# Altium project GALX4-0047N_PCB-1109N_REV-A.PrjPcb
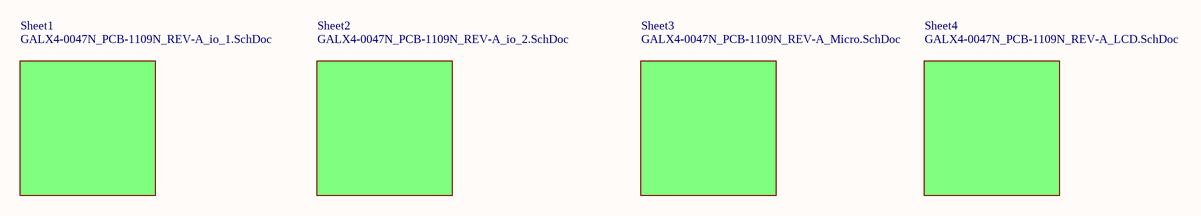
[diagram p0: GALX4-0047N_PCB-1109N_REV-A_Master.SchDoc]
5 sheets, 244 parts. Net scope: flat (ports and power ports of the same name join across sheets).
Board files: GALX4-0047N_PCB-1109N_REV-A_Panel.PcbDoc, GALX4-0047N_PCB-1109N_REV-A.PcbDoc
Sheets:
  GALX4-0047N_PCB-1109N_REV-A_Master.SchDoc
    Sheet1 = GALX4-0047N_PCB-1109N_REV-A_io_1.SchDoc
    Sheet2 = GALX4-0047N_PCB-1109N_REV-A_io_2.SchDoc
    Sheet3 = GALX4-0047N_PCB-1109N_REV-A_Micro.SchDoc
    Sheet4 = GALX4-0047N_PCB-1109N_REV-A_LCD.SchDoc

## Sheet GALX4-0047N_PCB-1109N_REV-A_Master.SchDoc
size 431 x 279 mm

### Sub-sheets
Sheet1 = GALX4-0047N_PCB-1109N_REV-A_io_1.SchDoc: no entries
Sheet2 = GALX4-0047N_PCB-1109N_REV-A_io_2.SchDoc: no entries
Sheet3 = GALX4-0047N_PCB-1109N_REV-A_Micro.SchDoc: no entries
Sheet4 = GALX4-0047N_PCB-1109N_REV-A_LCD.SchDoc: no entries

## Sheet GALX4-0047N_PCB-1109N_REV-A_io_1.SchDoc
size 431 x 279 mm; SheetNumber: 1; SheetTotal: 1; DocumentName: Sheet1.SCHDOC
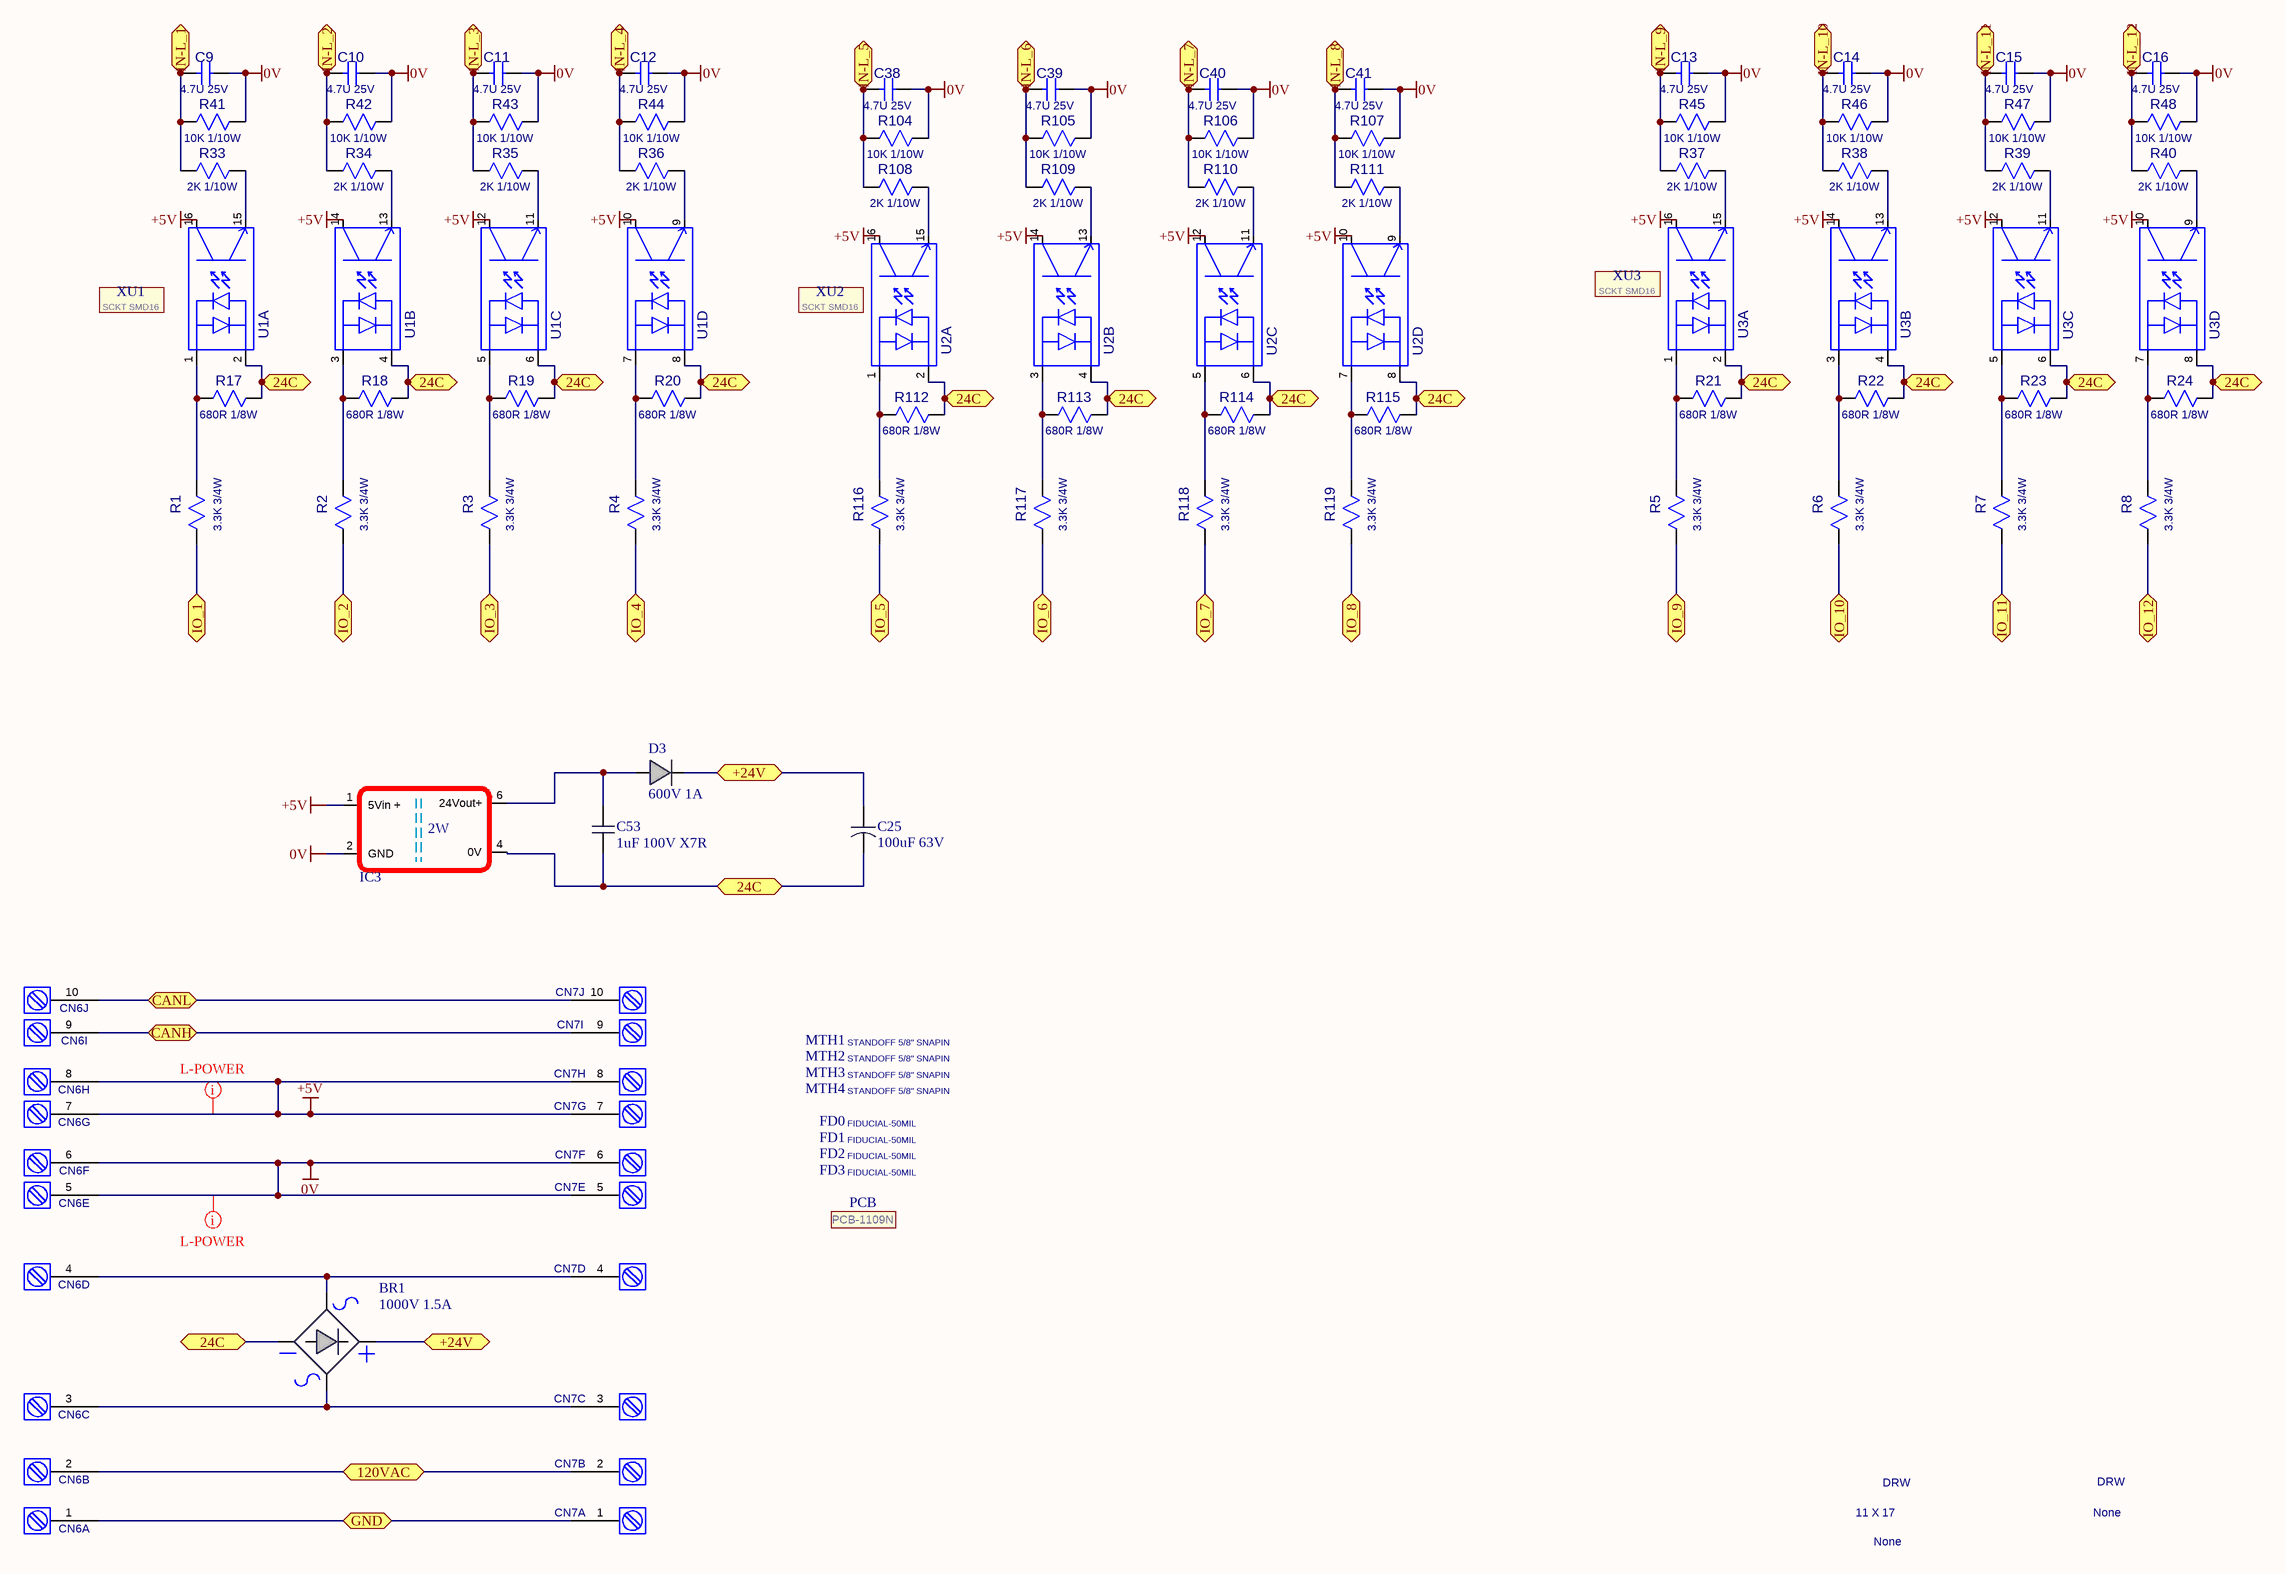
[diagram p1: GALX4-0047N_PCB-1109N_REV-A_io_1.SchDoc]

### Parts
BR1  1000V 1.5A  [SDIP4]
C9  value 4.7U 25V  [0805]  (hidden comment: CAP-0098N)
C10  value 4.7U 25V  [0805]  (hidden comment: CAP-0098N)
C11  value 4.7U 25V  [0805]  (hidden comment: CAP-0098N)
C12  value 4.7U 25V  [0805]  (hidden comment: CAP-0098N)
C13  value 4.7U 25V  [0805]  (hidden comment: CAP-0098N)
C14  value 4.7U 25V  [0805]  (hidden comment: CAP-0098N)
C15  value 4.7U 25V  [0805]  (hidden comment: CAP-0098N)
C16  value 4.7U 25V  [0805]  (hidden comment: CAP-0098N)
C25  100uF 63V  [D10.3]
C38  value 4.7U 25V  [0805]  (hidden comment: CAP-0098N)
C39  value 4.7U 25V  [0805]  (hidden comment: CAP-0098N)
C40  value 4.7U 25V  [0805]  (hidden comment: CAP-0098N)
C41  value 4.7U 25V  [0805]  (hidden comment: CAP-0098N)
C53  1uF 100V X7R  [1206 - CAP]
CN6  CONN-0193N  [CN_150_10P_VERT]  (value not drawn)  (parts A,B,C,D,E,F,G,H,I,J of 10)
CN7  CONN-0193N  [CN_150_10P_VERT]  (value not drawn)  (parts A,B,C,D,E,F,G,H,I,J of 10)
D3  600V 1A  [SMA]
FD0  FIDUCIAL-50MIL  [FIDUCIAL-50MIL]  (no BOM)
FD1  FIDUCIAL-50MIL  [FIDUCIAL-50MIL]  (no BOM)
FD2  FIDUCIAL-50MIL  [FIDUCIAL-50MIL]  (no BOM)
FD3  FIDUCIAL-50MIL  [FIDUCIAL-50MIL]  (no BOM)
IC3  PDM2-S5-S24-S  [PDM2-S5-S24-S]  (value not drawn)
MTH1  value STANDOFF 5/8" SNAPIN  [STANDOFF-8-5/8"]  (hidden comment: HWPC-0018N)
MTH2  value STANDOFF 5/8" SNAPIN  [STANDOFF-8-5/8"]  (hidden comment: HWPC-0018N)
MTH3  value STANDOFF 5/8" SNAPIN  [STANDOFF-8-5/8"]  (hidden comment: HWPC-0018N)
MTH4  value STANDOFF 5/8" SNAPIN  [STANDOFF-8-5/8"]  (hidden comment: HWPC-0018N)
PCB  GAL P/N: PCB-1109N  (hidden comment: PCB)  (mechanical)
R1  value 3.3K 3/4W  [2010]  (hidden comment: RES-0348N)
R2  value 3.3K 3/4W  [2010]  (hidden comment: RES-0348N)
R3  value 3.3K 3/4W  [2010]  (hidden comment: RES-0348N)
R4  value 3.3K 3/4W  [2010]  (hidden comment: RES-0348N)
R5  value 3.3K 3/4W  [2010]  (hidden comment: RES-0348N)
R6  value 3.3K 3/4W  [2010]  (hidden comment: RES-0348N)
R7  value 3.3K 3/4W  [2010]  (hidden comment: RES-0348N)
R8  value 3.3K 3/4W  [2010]  (hidden comment: RES-0348N)
R17  value 680R 1/8W  [0805]  (hidden comment: RES-0338N)
R18  value 680R 1/8W  [0805]  (hidden comment: RES-0338N)
R19  value 680R 1/8W  [0805]  (hidden comment: RES-0338N)
R20  value 680R 1/8W  [0805]  (hidden comment: RES-0338N)
R21  value 680R 1/8W  [0805]  (hidden comment: RES-0338N)
R22  value 680R 1/8W  [0805]  (hidden comment: RES-0338N)
R23  value 680R 1/8W  [0805]  (hidden comment: RES-0338N)
R24  value 680R 1/8W  [0805]  (hidden comment: RES-0338N)
R33  value 2K 1/10W  [0603]  (hidden comment: RES-0315N)
R34  value 2K 1/10W  [0603]  (hidden comment: RES-0315N)
R35  value 2K 1/10W  [0603]  (hidden comment: RES-0315N)
R36  value 2K 1/10W  [0603]  (hidden comment: RES-0315N)
R37  value 2K 1/10W  [0603]  (hidden comment: RES-0315N)
R38  value 2K 1/10W  [0603]  (hidden comment: RES-0315N)
R39  value 2K 1/10W  [0603]  (hidden comment: RES-0315N)
R40  value 2K 1/10W  [0603]  (hidden comment: RES-0315N)
R41  value 10K 1/10W  [0603]  (hidden comment: RES-0314N)
R42  value 10K 1/10W  [0603]  (hidden comment: RES-0314N)
R43  value 10K 1/10W  [0603]  (hidden comment: RES-0314N)
R44  value 10K 1/10W  [0603]  (hidden comment: RES-0314N)
R45  value 10K 1/10W  [0603]  (hidden comment: RES-0314N)
R46  value 10K 1/10W  [0603]  (hidden comment: RES-0314N)
R47  value 10K 1/10W  [0603]  (hidden comment: RES-0314N)
R48  value 10K 1/10W  [0603]  (hidden comment: RES-0314N)
R104  value 10K 1/10W  [0603]  (hidden comment: RES-0314N)
R105  value 10K 1/10W  [0603]  (hidden comment: RES-0314N)
R106  value 10K 1/10W  [0603]  (hidden comment: RES-0314N)
R107  value 10K 1/10W  [0603]  (hidden comment: RES-0314N)
R108  value 2K 1/10W  [0603]  (hidden comment: RES-0315N)
R109  value 2K 1/10W  [0603]  (hidden comment: RES-0315N)
R110  value 2K 1/10W  [0603]  (hidden comment: RES-0315N)
R111  value 2K 1/10W  [0603]  (hidden comment: RES-0315N)
R112  value 680R 1/8W  [0805]  (hidden comment: RES-0338N)
R113  value 680R 1/8W  [0805]  (hidden comment: RES-0338N)
R114  value 680R 1/8W  [0805]  (hidden comment: RES-0338N)
R115  value 680R 1/8W  [0805]  (hidden comment: RES-0338N)
R116  value 3.3K 3/4W  [2010]  (hidden comment: RES-0348N)
R117  value 3.3K 3/4W  [2010]  (hidden comment: RES-0348N)
R118  value 3.3K 3/4W  [2010]  (hidden comment: RES-0348N)
R119  value 3.3K 3/4W  [2010]  (hidden comment: RES-0348N)
U1  IC-0068N  [DIP16FORSMD]  (value not drawn)  (parts A,B,C,D of 4)
U2  IC-0068N  [DIP16FORSMD]  (value not drawn)  (parts A,B,C,D of 4)
U3  IC-0068N  [DIP16FORSMD]  (value not drawn)  (parts A,B,C,D of 4)
XU1  value SCKT SMD16  [SCKT-SMD16]  (hidden comment: SCKT-0029N)
XU2  value SCKT SMD16  [SCKT-SMD16]  (hidden comment: SCKT-0029N)
XU3  value SCKT SMD16  [SCKT-SMD16]  (hidden comment: SCKT-0029N)

### Ports
24C, 120VAC (bidir), +24V, CANH, CANL, GND, IN-L_1, IN-L_2, IN-L_3, IN-L_4, IN-L_5, IN-L_6, IN-L_7, IN-L_8, IN-L_9 (bidir), IN-L_10 (bidir), IN-L_11 (bidir), IN-L_12 (bidir), IO_1, IO_2, IO_3, IO_4, IO_5, IO_6, IO_7, IO_8, IO_9 (bidir), IO_10 (bidir), IO_11 (bidir), IO_12 (bidir)

### Nets
0V: C9.2(B) C10.2(B) C11.2(B) C12.2(B) C13.2(B) C14.2(B) C15.2(B) C16.2(B) C38.2(B) C39.2(B) C40.2(B) C41.2(B) CN6.5 CN6.6 CN7.5 CN7.6 IC3.2(GND) R41.2 R42.2 R43.2 R44.2 R45.2 R46.2 R47.2 R48.2 R104.2 R105.2 R106.2 R107.2
+5V: CN6.7 CN6.8 CN7.7 CN7.8 IC3.1(5Vin_+) U1.10 U1.12 U1.14 U1.16 U2.10 U2.12 U2.14 U2.16 U3.10 U3.12 U3.14 U3.16
24C: BR1.2(-) C25.2 C53.1(A) IC3.4(0V) R17.2 R18.2 R19.2 R20.2 R21.2 R22.2 R23.2 R24.2 R112.2 R113.2 R114.2 R115.2 U1.2 U1.4 U1.6 U1.8 U2.2 U2.4 U2.6 U2.8 U3.2 U3.4 U3.6 U3.8 ; port 24C
120VAC: CN6.2 CN7.2 ; port 120VAC
+24V: BR1.1(+) C25.1 D3.2 ; port +24V
CANH: CN6.9 CN7.9 ; port CANH
CANL: CN6.10 CN7.10 ; port CANL
GND: CN6.1 CN7.1 ; port GND
IN-L_1: C9.1(A) R33.1 R41.1 ; port IN-L_1
IN-L_2: C10.1(A) R34.1 R42.1 ; port IN-L_2
IN-L_3: C11.1(A) R35.1 R43.1 ; port IN-L_3
IN-L_4: C12.1(A) R36.1 R44.1 ; port IN-L_4
IN-L_5: C38.1(A) R104.1 R108.1 ; port IN-L_5
IN-L_6: C39.1(A) R105.1 R109.1 ; port IN-L_6
IN-L_7: C40.1(A) R106.1 R110.1 ; port IN-L_7
IN-L_8: C41.1(A) R107.1 R111.1 ; port IN-L_8
IN-L_9: C13.1(A) R37.1 R45.1 ; port IN-L_9
IN-L_10: C14.1(A) R38.1 R46.1 ; port IN-L_10
IN-L_11: C15.1(A) R39.1 R47.1 ; port IN-L_11
IN-L_12: C16.1(A) R40.1 R48.1 ; port IN-L_12
IO_1: R1.1 ; port IO_1
IO_2: R2.1 ; port IO_2
IO_3: R3.1 ; port IO_3
IO_4: R4.1 ; port IO_4
IO_5: R116.1 ; port IO_5
IO_6: R117.1 ; port IO_6
IO_7: R118.1 ; port IO_7
IO_8: R119.1 ; port IO_8
IO_9: R5.1 ; port IO_9
IO_10: R6.1 ; port IO_10
IO_11: R7.1 ; port IO_11
IO_12: R8.1 ; port IO_12
NetBR1_3: BR1.3(AC_1) CN6.4 CN7.4
NetBR1_4: BR1.4(AC_2) CN6.3 CN7.3
NetC53_2: C53.2(B) D3.1 IC3.6(24Vout+)
NetR1_2: R1.2 R17.1 U1.1
NetR2_2: R2.2 R18.1 U1.3
NetR3_2: R3.2 R19.1 U1.5
NetR4_2: R4.2 R20.1 U1.7
NetR5_2: R5.2 R21.1 U3.1
NetR6_2: R6.2 R22.1 U3.3
NetR7_2: R7.2 R23.1 U3.5
NetR8_2: R8.2 R24.1 U3.7
NetR33_2: R33.2 U1.15
NetR34_2: R34.2 U1.13
NetR35_2: R35.2 U1.11
NetR36_2: R36.2 U1.9
NetR37_2: R37.2 U3.15
NetR38_2: R38.2 U3.13
NetR39_2: R39.2 U3.11
NetR40_2: R40.2 U3.9
NetR108_2: R108.2 U2.15
NetR109_2: R109.2 U2.13
NetR110_2: R110.2 U2.11
NetR111_2: R111.2 U2.9
NetR112_1: R112.1 R116.2 U2.1
NetR113_1: R113.1 R117.2 U2.3
NetR114_1: R114.1 R118.2 U2.5
NetR115_1: R115.1 R119.2 U2.7

### Layout directives
net class L-POWER: 0V, +5V

### Notes on the sheet
- DRW
- 11 X 17
- None
- TITLE:
- S
- DWG BY
- E
- L
- V
- A
- T
- O
- R
- D
- I
- C
- 50 EAST 153rd STREET
- ENGINEER
- DWG. No.
- BRONX, N.Y. 10451
- REV
- DESCRIPTION
- ECN NO.
- DATE
- SIZE
- SCALE
- PART No.
- FILE NAME
- SHEET __ 0F __
- REV.
- (in symbol IC-PDM2-S5-S24-S) 2W

### Library data of the parts
BR1 = DIOD-0081N: DIODE,RECT BRIDGE 1000V 1.5A 4SDIP SMT; MANUFACTURER: FAIRCHILD; MFG PART ID: DF10S; PLACE: S; UNIT $: 0.1144; Value: 1000V 1.5A BR; CERTIFICATES/APPROVALS: UL #E111753 and E326243.; GAL DESC.: DIODE,RECT BRIDGE 1000V 1.5A 4SDIP SMT; GAL P/N: DIOD-0081N; PART TYPE: SDIP4; TEMPERATURE: -55 to +150 C; RoHs COMPLIANT: YES
C9-C16 C38-C41 = CAP-0098N: C-0805-D-4.7U-25V-10%; MANUFACTURER: MURATA; MFG PART ID: GRM21BR61E475KA12L; GAL DESC.: CAP 4.7UF 25V 10% CERM 0805 SMT; PLACE: S; UNIT $: $0.0520; GAL P/N: CAP-0098N; PART TYPE: 0805-050; VENDOR: *; VENDOR ID: *
C25 = CAP-0104N: CAP, 100UF 63V ELECT 20% 10.3MM SMT; MANUFACTURER: UNITED CHEMICON; MFG PART ID: EMVE630ADA101MJA0G; PLACE: S; UNIT $: 0.3; GAL DESC.: CAP, 100UF 63V ELECT 20% 10.3MM SMT; GAL P/N: CAP-0104N; PART TYPE: D10.3; TEMPERATURE: -40°C ~ 105°C; Value: 100uF 63V
C53 = CAP-0110N: CAP, 1UF 100V 10% X7R CERM 1206 SMT; MANUFACTURER: MURATA; MFG PART ID: GRM31CR72A105KA01L; PLACE: S; UNIT $: 0.12016; GAL DESC.: CAP, 1UF 100V 10% X7R CERM 1206 SMT; GAL P/N: CAP-0110N; PART TYPE: 1206; RoHs COMPLIANT: YES; TEMPERATURE: -55°C ~ 125°C; Value: 1uF 100V X7R
CN6 CN7 = CONN-0193N: CN_150_10P_VERT; MANUFACTURER: PHOENIX; Value: 250V 8A; VENDOR ID: 1803507; GAL DESC.: CONN,HEADER 10 POS PCB TERMINAL 3.81 MM; PLACE: M; UNIT $: $0.8500; VENDOR: SAGER; GAL P/N: CONN-0193N; PART TYPE: CONN-0193N; MFG PART ID: 1803507
D3 = DIOD-0077N: DIODE,FAST 600V 1A SMA SMT; MANUFACTURER: STMICRO; MFG PART ID: STTH1L06A; PLACE: S; UNIT $: 0.102; CERTIFICATES/APPROVALS: Epoxy meets UL 94, V0; GAL DESC.: DIODE,FAST 600V 1A SMA SMT; GAL P/N: DIOD-0077N; PART TYPE: SMA; TEMPERATURE: -65°C ~ 175°C; Value: 600V 1A
IC3 = IC-PDM2-S5-S24-S: CONV DC/DC 2W  5 --> 24V OUT SIP4; MANUFACTURER: CUI INC; CERTIFICATES/APPROVALS: UL; GAL DESC.: CONV DC/DC 2W SGL 5V-->24V OUT SIP4; PLACE: M; UNIT $: 4.57; Value: 5V to 24V 2W Boost; HelpURL: http://www.cui.com/product/resource/pdm2-s.pdff; MFG PART ID: PDM2-S5-S24-S; PART TYPE: SIP 4 MODULE; RoHs COMPLIANT: YES; TEMPERATURE: -40°C ~ 85°C
MTH1-MTH4 = HWPC-0018N: STANDOFF-5/8-SNAP; MANUFACTURER: KEYSTONE; MFG PART ID: 8842; UNIT $: $0.0773; PLACE: PW; GAL DESC.: STANDOFF,SNAP IN NYLON 5/8" LG; VENDOR: *; PART TYPE: HWPC-0018N; GAL P/N: HWPC-0018N; VENDOR ID: *
PCB = PCB: PCB-0205N; MANUFACTURER: CIRCUIT ENG; MFG PART ID: PCB-0176N; UNIT $: $5.0000; PLACE: M; GAL DESC.: PCB, GALX-1078AN REV B; VENDOR: *; PART TYPE: PCB; VENDOR ID: *
R1-R8 R116-R119 = RES-0348N: R-2010-B-3.3K-3/4-5%; MANUFACTURER: KOA SPEER; MFG PART ID: RK73B2HTTE332J; PLACE: S; GAL DESC.: RES, 3.3KOHM 3/4W 5% 2010 SMT; UNIT $: $0.0050; GAL P/N: RES-0348N; PART TYPE: 2010; VENDOR: *; VENDOR ID: *
R17-R24 R112-R115 = RES-0338N: R-0805-A-680R-1/8-5%; MANUFACTURER: YAGEO; MFG PART ID: RC0805JR-07680RL; PLACE: S; GAL DESC.: RES, 680 OHM 1/8W 5% 0805 SMT; UNIT $: $0.0038; GAL P/N: RES-0338N; PART TYPE: 0805; VENDOR: *; VENDOR ID: *
R33-R40 R108-R111 = RES-0315N: R-0603-B-2.0K-1/10-5%; MANUFACTURER: PANASONIC-ECG; MFG PART ID: ERJ-3GEYJ202V; PLACE: S; GAL DESC.: RES, 2.0KOHM 1/10W 5% 0603 SMT; UNIT $: $0.0024; GAL P/N: RES-0315N; PART TYPE: 0603; VENDOR: *; VENDOR ID: *
R41-R48 R104-R107 = RES-0314N: R-0603-B-10.0K-1/10-5%; MANUFACTURER: PANASONIC-ECG; MFG PART ID: ERJ-3GEYJ103V; PLACE: S; GAL DESC.: RES, 10.0KOHM 1/10W 5% 0603 SMT; UNIT $: $0.0024; GAL P/N: RES-0314N; PART TYPE: 0603; VENDOR: *; VENDOR ID: *
U1-U3 = IC-0068N: LTV-844-DIP16; MANUFACTURER: LITE-ON; GAL DESC.: IC,OPTOISOLATOR 4CH AC-IN 16PIN DIP; UNIT $: $0.6477; PLACE: D; REPAIR: -00002; SLOT: 00337; Value: IC-0068N; GAL P/N: IC-0068N; VENDOR ID: *; VENDOR: *; MFG PART ID: LTV-844; PART TYPE: DIP16; DEPTH: +00001
XU1-XU3 = SCKT-0029N: SOCKET_SMD16; MANUFACTURER: MILL-MAX; MFG PART ID: 214-44-316-01-670800; UNIT $: $0.8000; PLACE: S; GAL DESC.: SOCKET,16 PIN CLOSED FRAME 16SMD SMT; VENDOR: *; PART TYPE: SCKT_SMD16; GAL P/N: SCKT-0029N; VENDOR ID: *
FD0-FD3 = FIDUCIAL-50MIL: MANUFACTURER: *; VENDOR: *; PART TYPE: *; UNIT $: *; MFG PART ID: *; PLACE: *; GAL P/N: *; VENDOR ID: *; GAL DESC.: FIDUCIAL; Value: FIDUCIAL-50MIL

## Sheet GALX4-0047N_PCB-1109N_REV-A_io_2.SchDoc
size 431 x 279 mm; SheetNumber: 1; SheetTotal: 1; DocumentName: Sheet1.SCHDOC
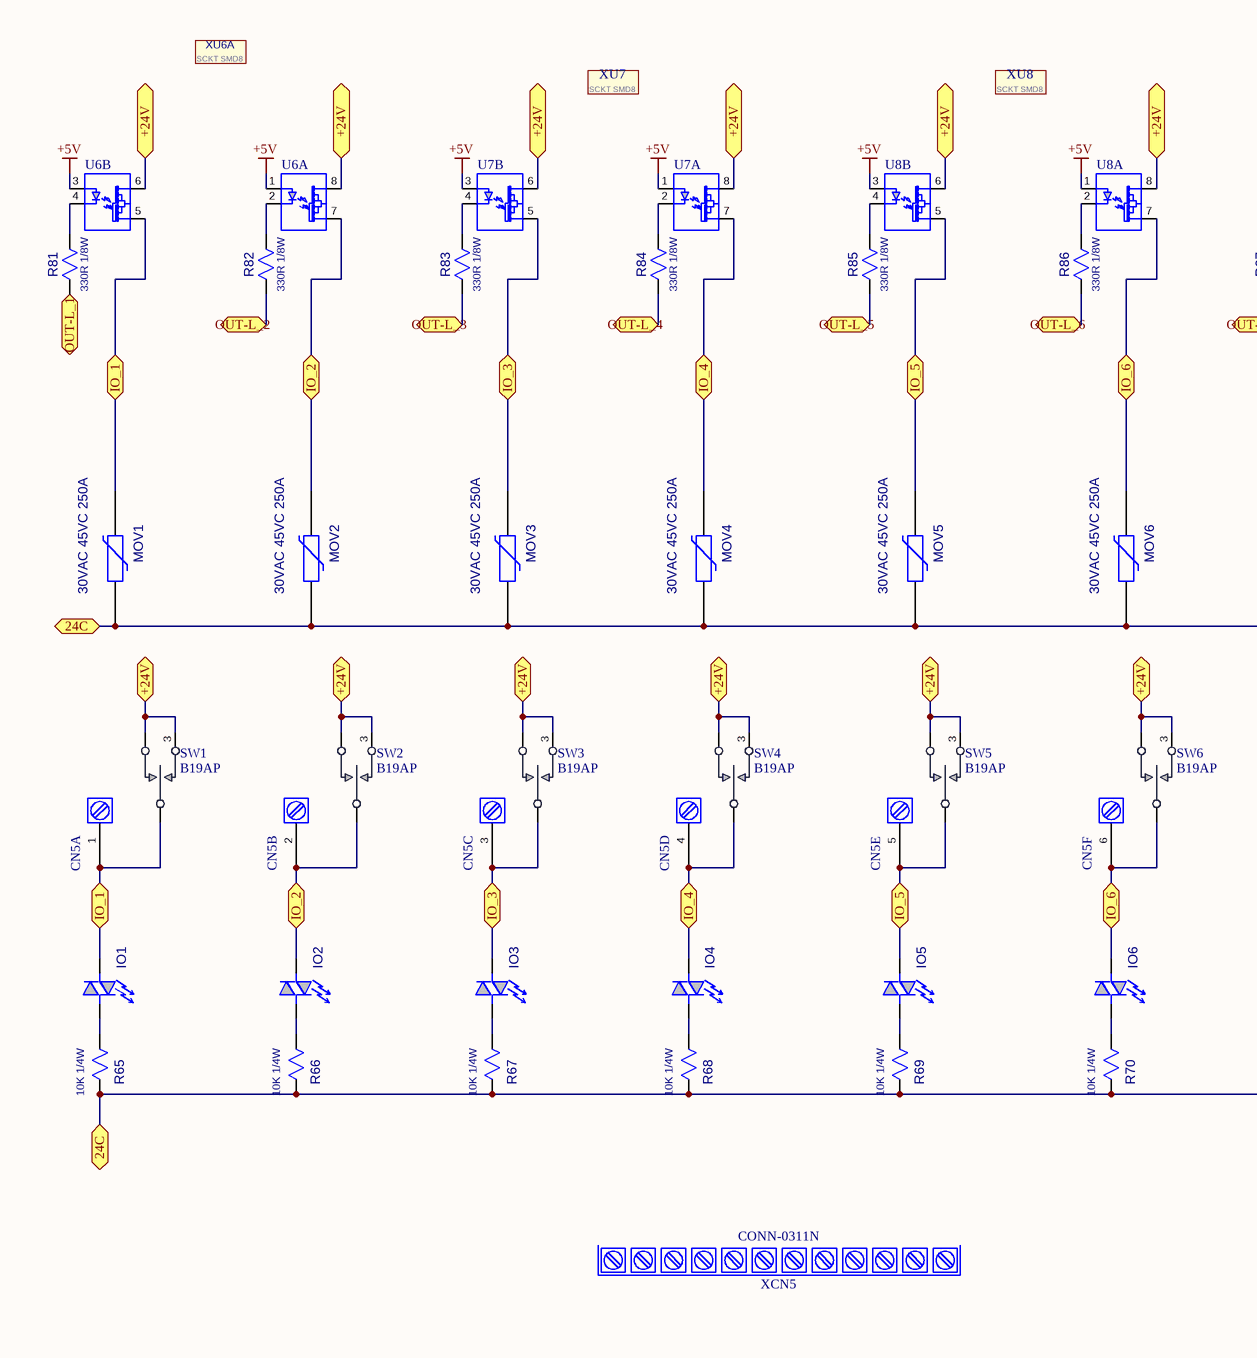
[diagram p2: GALX4-0047N_PCB-1109N_REV-A_io_2.SchDoc, left]
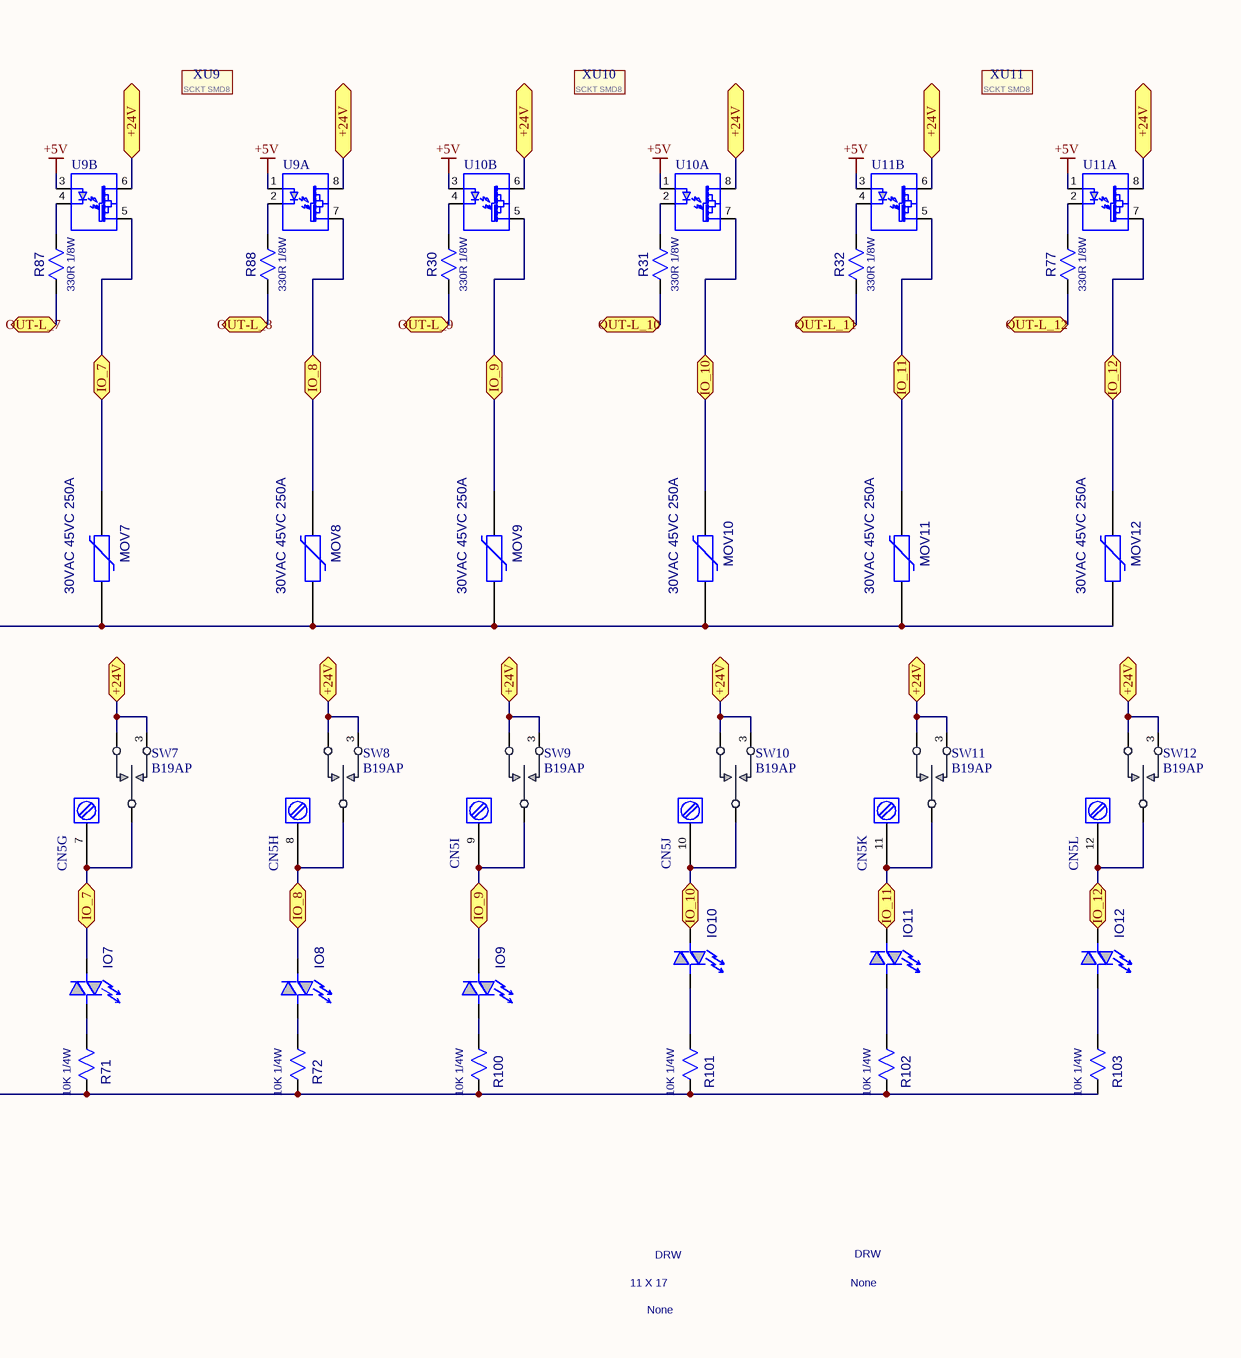
[diagram p3: GALX4-0047N_PCB-1109N_REV-A_io_2.SchDoc, right]

### Parts
CN5  CONN-0310N  [CNPIN-5MM-12P-NOSCR]  (value not drawn)  (parts A,B,C,D,E,F,G,H,I,J,K,L of 12)
IO1  LED-0013N  [1206-LED-GREEN]  (value not drawn)
IO2  LED-0013N  [1206-LED-GREEN]  (value not drawn)
IO3  LED-0013N  [1206-LED-GREEN]  (value not drawn)
IO4  LED-0013N  [1206-LED-GREEN]  (value not drawn)
IO5  LED-0013N  [1206-LED-GREEN]  (value not drawn)
IO6  LED-0013N  [1206-LED-GREEN]  (value not drawn)
IO7  LED-0013N  [1206-LED-GREEN]  (value not drawn)
IO8  LED-0013N  [1206-LED-GREEN]  (value not drawn)
IO9  LED-0013N  [1206-LED-GREEN]  (value not drawn)
IO10  LED-0013N  [1206-LED-GREEN]  (value not drawn)
IO11  LED-0013N  [1206-LED-GREEN]  (value not drawn)
IO12  LED-0013N  [1206-LED-GREEN]  (value not drawn)
MOV1  value 30VAC 45VC 250A  [DISC-280DX150WX200P]  (hidden comment: MOV-0012N)
MOV2  value 30VAC 45VC 250A  [DISC-280DX150WX200P]  (hidden comment: MOV-0012N)
MOV3  value 30VAC 45VC 250A  [DISC-280DX150WX200P]  (hidden comment: MOV-0012N)
MOV4  value 30VAC 45VC 250A  [DISC-280DX150WX200P]  (hidden comment: MOV-0012N)
MOV5  value 30VAC 45VC 250A  [DISC-280DX150WX200P]  (hidden comment: MOV-0012N)
MOV6  value 30VAC 45VC 250A  [DISC-280DX150WX200P]  (hidden comment: MOV-0012N)
MOV7  value 30VAC 45VC 250A  [DISC-280DX150WX200P]  (hidden comment: MOV-0012N)
MOV8  value 30VAC 45VC 250A  [DISC-280DX150WX200P]  (hidden comment: MOV-0012N)
MOV9  value 30VAC 45VC 250A  [DISC-280DX150WX200P]  (hidden comment: MOV-0012N)
MOV10  value 30VAC 45VC 250A  [DISC-280DX150WX200P]  (hidden comment: MOV-0012N)
MOV11  value 30VAC 45VC 250A  [DISC-280DX150WX200P]  (hidden comment: MOV-0012N)
MOV12  value 30VAC 45VC 250A  [DISC-280DX150WX200P]  (hidden comment: MOV-0012N)
R30  value 330R 1/8W  [0805]  (hidden comment: RES-0291N)
R31  value 330R 1/8W  [0805]  (hidden comment: RES-0291N)
R32  value 330R 1/8W  [0805]  (hidden comment: RES-0291N)
R65  value 10K 1/4W  [1206]  (hidden comment: RES-0294N)
R66  value 10K 1/4W  [1206]  (hidden comment: RES-0294N)
R67  value 10K 1/4W  [1206]  (hidden comment: RES-0294N)
R68  value 10K 1/4W  [1206]  (hidden comment: RES-0294N)
R69  value 10K 1/4W  [1206]  (hidden comment: RES-0294N)
R70  value 10K 1/4W  [1206]  (hidden comment: RES-0294N)
R71  value 10K 1/4W  [1206]  (hidden comment: RES-0294N)
R72  value 10K 1/4W  [1206]  (hidden comment: RES-0294N)
R77  value 330R 1/8W  [0805]  (hidden comment: RES-0291N)
R81  value 330R 1/8W  [0805]  (hidden comment: RES-0291N)
R82  value 330R 1/8W  [0805]  (hidden comment: RES-0291N)
R83  value 330R 1/8W  [0805]  (hidden comment: RES-0291N)
R84  value 330R 1/8W  [0805]  (hidden comment: RES-0291N)
R85  value 330R 1/8W  [0805]  (hidden comment: RES-0291N)
R86  value 330R 1/8W  [0805]  (hidden comment: RES-0291N)
R87  value 330R 1/8W  [0805]  (hidden comment: RES-0291N)
R88  value 330R 1/8W  [0805]  (hidden comment: RES-0291N)
R100  value 10K 1/4W  [1206]  (hidden comment: RES-0294N)
R101  value 10K 1/4W  [1206]  (hidden comment: RES-0294N)
R102  value 10K 1/4W  [1206]  (hidden comment: RES-0294N)
R103  value 10K 1/4W  [1206]  (hidden comment: RES-0294N)
SW1  ON-OFF-MON  [B19AP]  (value not drawn)
SW2  ON-OFF-MON  [B19AP]  (value not drawn)
SW3  ON-OFF-MON  [B19AP]  (value not drawn)
SW4  ON-OFF-MON  [B19AP]  (value not drawn)
SW5  ON-OFF-MON  [B19AP]  (value not drawn)
SW6  ON-OFF-MON  [B19AP]  (value not drawn)
SW7  ON-OFF-MON  [B19AP]  (value not drawn)
SW8  ON-OFF-MON  [B19AP]  (value not drawn)
SW9  ON-OFF-MON  [B19AP]  (value not drawn)
SW10  ON-OFF-MON  [B19AP]  (value not drawn)
SW11  ON-OFF-MON  [B19AP]  (value not drawn)
SW12  ON-OFF-MON  [B19AP]  (value not drawn)
U6  IC-0187N  [DIP8FORSMD]  (value not drawn)  (parts A,B of 2)
U7  IC-0187N  [DIP8FORSMD]  (value not drawn)  (parts A,B of 2)
U8  IC-0187N  [DIP8FORSMD]  (value not drawn)  (parts A,B of 2)
U9  IC-0187N  [DIP8FORSMD]  (value not drawn)  (parts A,B of 2)
U10  IC-0187N  [DIP8FORSMD]  (value not drawn)  (parts A,B of 2)
U11  IC-0187N  [DIP8FORSMD]  (value not drawn)  (parts A,B of 2)
XCN5  CONN-0311N  (mechanical)
XU6A  value SCKT SMD8  [SCKT-SMD8]  (hidden comment: SCKT-0028N)
XU7  value SCKT SMD8  [SCKT-SMD8]  (hidden comment: SCKT-0028N)
XU8  value SCKT SMD8  [SCKT-SMD8]  (hidden comment: SCKT-0028N)
XU9  value SCKT SMD8  [SCKT-SMD8]  (hidden comment: SCKT-0028N)
XU10  value SCKT SMD8  [SCKT-SMD8]  (hidden comment: SCKT-0028N)
XU11  value SCKT SMD8  [SCKT-SMD8]  (hidden comment: SCKT-0028N)

### Ports
24C, +24V (bidir), IO_1, IO_2, IO_3, IO_4, IO_5, IO_6, IO_7, IO_8, IO_9 (bidir), IO_10 (bidir), IO_11 (bidir), IO_12 (bidir), OUT-L_1, OUT-L_2, OUT-L_3, OUT-L_4, OUT-L_5, OUT-L_6, OUT-L_7, OUT-L_8, OUT-L_9 (bidir), OUT-L_10 (bidir), OUT-L_11 (bidir), OUT-L_12 (bidir)

### Nets
+5V: U6.1 U6.3 U7.1 U7.3 U8.1 U8.3 U9.1 U9.3 U10.1 U10.3 U11.1 U11.3
24C: MOV1.2 MOV2.2 MOV3.2 MOV4.2 MOV5.2 MOV6.2 MOV7.2 MOV8.2 MOV9.2 MOV10.2 MOV11.2 MOV12.2 R65.2 R66.2 R67.2 R68.2 R69.2 R70.2 R71.2 R72.2 R100.2 R101.2 R102.2 R103.2 ; port 24C
+24V: SW1.1 SW1.3(MON) SW2.1 SW2.3(MON) SW3.1 SW3.3(MON) SW4.1 SW4.3(MON) SW5.1 SW5.3(MON) SW6.1 SW6.3(MON) SW7.1 SW7.3(MON) SW8.1 SW8.3(MON) SW9.1 SW9.3(MON) SW10.1 SW10.3(MON) SW11.1 SW11.3(MON) SW12.1 SW12.3(MON) U6.6 U6.8 U7.6 U7.8 U8.6 U8.8 U9.6 U9.8 U10.6 U10.8 U11.6 U11.8 ; port +24V
IO_1: CN5.1 IO1.1 MOV1.1 SW1.2 U6.5 ; port IO_1
IO_2: CN5.2 IO2.1 MOV2.1 SW2.2 U6.7 ; port IO_2
IO_3: CN5.3 IO3.1 MOV3.1 SW3.2 U7.5 ; port IO_3
IO_4: CN5.4 IO4.1 MOV4.1 SW4.2 U7.7 ; port IO_4
IO_5: CN5.5 IO5.1 MOV5.1 SW5.2 U8.5 ; port IO_5
IO_6: CN5.6 IO6.1 MOV6.1 SW6.2 U8.7 ; port IO_6
IO_7: CN5.7 IO7.1 MOV7.1 SW7.2 U9.5 ; port IO_7
IO_8: CN5.8 IO8.1 MOV8.1 SW8.2 U9.7 ; port IO_8
IO_9: CN5.9 IO9.1 MOV9.1 SW9.2 U10.5 ; port IO_9
IO_10: CN5.10 IO10.1 MOV10.1 SW10.2 U10.7 ; port IO_10
IO_11: CN5.11 IO11.1 MOV11.1 SW11.2 U11.5 ; port IO_11
IO_12: CN5.12 IO12.1 MOV12.1 SW12.2 U11.7 ; port IO_12
OUT-L_1: R81.1 ; port OUT-L_1
OUT-L_2: R82.1 ; port OUT-L_2
OUT-L_3: R83.1 ; port OUT-L_3
OUT-L_4: R84.1 ; port OUT-L_4
OUT-L_5: R85.1 ; port OUT-L_5
OUT-L_6: R86.1 ; port OUT-L_6
OUT-L_7: R87.1 ; port OUT-L_7
OUT-L_8: R88.1 ; port OUT-L_8
OUT-L_9: R30.1 ; port OUT-L_9
OUT-L_10: R31.1 ; port OUT-L_10
OUT-L_11: R32.1 ; port OUT-L_11
OUT-L_12: R77.1 ; port OUT-L_12
NetIO1_2: IO1.2 R65.1
NetIO2_2: IO2.2 R66.1
NetIO3_2: IO3.2 R67.1
NetIO4_2: IO4.2 R68.1
NetIO5_2: IO5.2 R69.1
NetIO6_2: IO6.2 R70.1
NetIO7_2: IO7.2 R71.1
NetIO8_2: IO8.2 R72.1
NetIO9_2: IO9.2 R100.1
NetIO10_2: IO10.2 R101.1
NetIO11_2: IO11.2 R102.1
NetIO12_2: IO12.2 R103.1
NetR30_2: R30.2 U10.4
NetR31_2: R31.2 U10.2
NetR32_2: R32.2 U11.4
NetR77_2: R77.2 U11.2
NetR81_2: R81.2 U6.4
NetR82_2: R82.2 U6.2
NetR83_2: R83.2 U7.4
NetR84_2: R84.2 U7.2
NetR85_2: R85.2 U8.4
NetR86_2: R86.2 U8.2
NetR87_2: R87.2 U9.4
NetR88_2: R88.2 U9.2

### Notes on the sheet
- DRW
- 11 X 17
- None
- TITLE:
- S
- DWG BY
- E
- L
- V
- A
- T
- O
- R
- D
- I
- C
- 50 EAST 153rd STREET
- ENGINEER
- DWG. No.
- BRONX, N.Y. 10451
- REV
- DESCRIPTION
- ECN NO.
- DATE
- SIZE
- SCALE
- PART No.
- FILE NAME
- SHEET __ 0F __
- REV.

### Library data of the parts
CN5 = CONN-0310N: CNPIN_5MM_12P; MFG PART ID: 1933286; MANUFACTURER: PHOENIX; Value: 300V 10A; GAL DESC.: CONN,HEAD-M 12POS 5MMP 13MMH PTP REFLOW; PLACE: PTP; UNIT $: $0.4000; VENDOR ID: *; GAL P/N: CONN-0310N; PART TYPE: CONN-0310N; VENDOR: *
IO1-IO12 = LED-0013N: LED-1206-BI-G; MANUFACTURER: SUNLED; MFG PART ID: XZSGKSGK55W-7; Value: GREEN; GAL DESC.: LED,GREEN BI-POLAR DOME LENS 1206 SMT; PLACE: S; UNIT $: $0.2260; GAL P/N: LED-0013N; PART TYPE: 1206LED; VENDOR: SUNLED; VENDOR ID: LED-0013N
MOV1-MOV12 = MOV-0012N: MOV-30VAC-45VC-250A-7MM-STRAIGHT; MANUFACTURER: LITTLEFUSE; MFG PART ID: V47ZU1P; GAL DESC.: MOV,BI TVS 7MM 30VAC 38VDC 250A UCRMP; PLACE: R; UNIT $: $0.1350; SLOT: 00023; SPAN: 00200; GAL P/N: MOV-0012N; PART TYPE: DISC-7MM-STRAIGHT; VENDOR: *; VENDOR ID: *
R30-R32 R77 R81-R88 = RES-0291N: R-0805-A-330R-1/8-5%; MANUFACTURER: KOA SPEER; MFG PART ID: RK73B2ATTD331J; PLACE: S; GAL DESC.: RESISTOR,330OHM 1/8W 5% 0805 SMT; UNIT $: $0.0038; GAL P/N: RES-0291N; PART TYPE: 0805; VENDOR: *; VENDOR ID: *
R65-R72 R100-R103 = RES-0294N: R-1206-B-10K-1/4-1%; MANUFACTURER: VISHAY/DALE; MFG PART ID: CRCW120610K0FKEA; PLACE: S; GAL DESC.: RESISTOR,10KOHM 1/4W 1% 1206 SMT; UNIT $: $0.0090; GAL P/N: RES-0294N; PART TYPE: 1206; VENDOR: *; VENDOR ID: *
SW1-SW12 = SW-0083N: SWITCH,MOMENTARY TOGGLE; MANUFACTURER: NKK; GAL DESC.: SWITCH,MINIATURE TOGGLE ON-OFF-MON; PLACE: R; UNIT $: 1.057474; VENDOR: ARROW ELECTRONICS, INC.; GAL P/N: SW-0083N; PART TYPE: SW; VENDOR ID: SW-0083N; MFG PART ID: B19AP
U6-U11 = IC-0187N: SSR-2CHFET-60V-0.5A-DIP8; MANUFACTURER: PANASONIC; MFG PART ID: AQW212; VENDOR: EQUIPTEX; PLACE: D; UNIT $: $1.8900; GAL DESC.: IC, PHOTOMOS 2CH SSR 60V 0.5A 8DIP; REPAIR: -00002; SLOT: 00322; GAL P/N: IC-0187N; PART TYPE: DIP8; DEPTH: +00001
XCN5 = CONN-0311N: CN_5MM_12P_LABELED_PLUG(BOM); MFG PART ID: PT 1.5/12-PH-5.0 BD:1-12; MANUFACTURER: PHOENIX; Value: 250V 10A; GAL DESC.: CONN,PLUG-F 12POS 5MMP SCRW LABELS 1-12; PLACE: PW; UNIT $: $1.7000; GAL P/N: CONN-0311N; PART TYPE: CONN-0311N
XU6A XU7-XU11 = SCKT-0028N: SOCKET_SMD8; MANUFACTURER: MILL-MAX; MFG PART ID: 214-44-308-01-670800; UNIT $: $0.5000; PLACE: S; GAL DESC.: SOCKET,8 PIN CLOSED FRAME 8SMD SMT; VENDOR: *; PART TYPE: SCKT_SMD8; GAL P/N: SCKT-0028N; VENDOR ID: *

## Sheet GALX4-0047N_PCB-1109N_REV-A_Micro.SchDoc
size 431 x 279 mm; SheetNumber: 1; SheetTotal: 1; DocumentName: Sheet1.SCHDOC
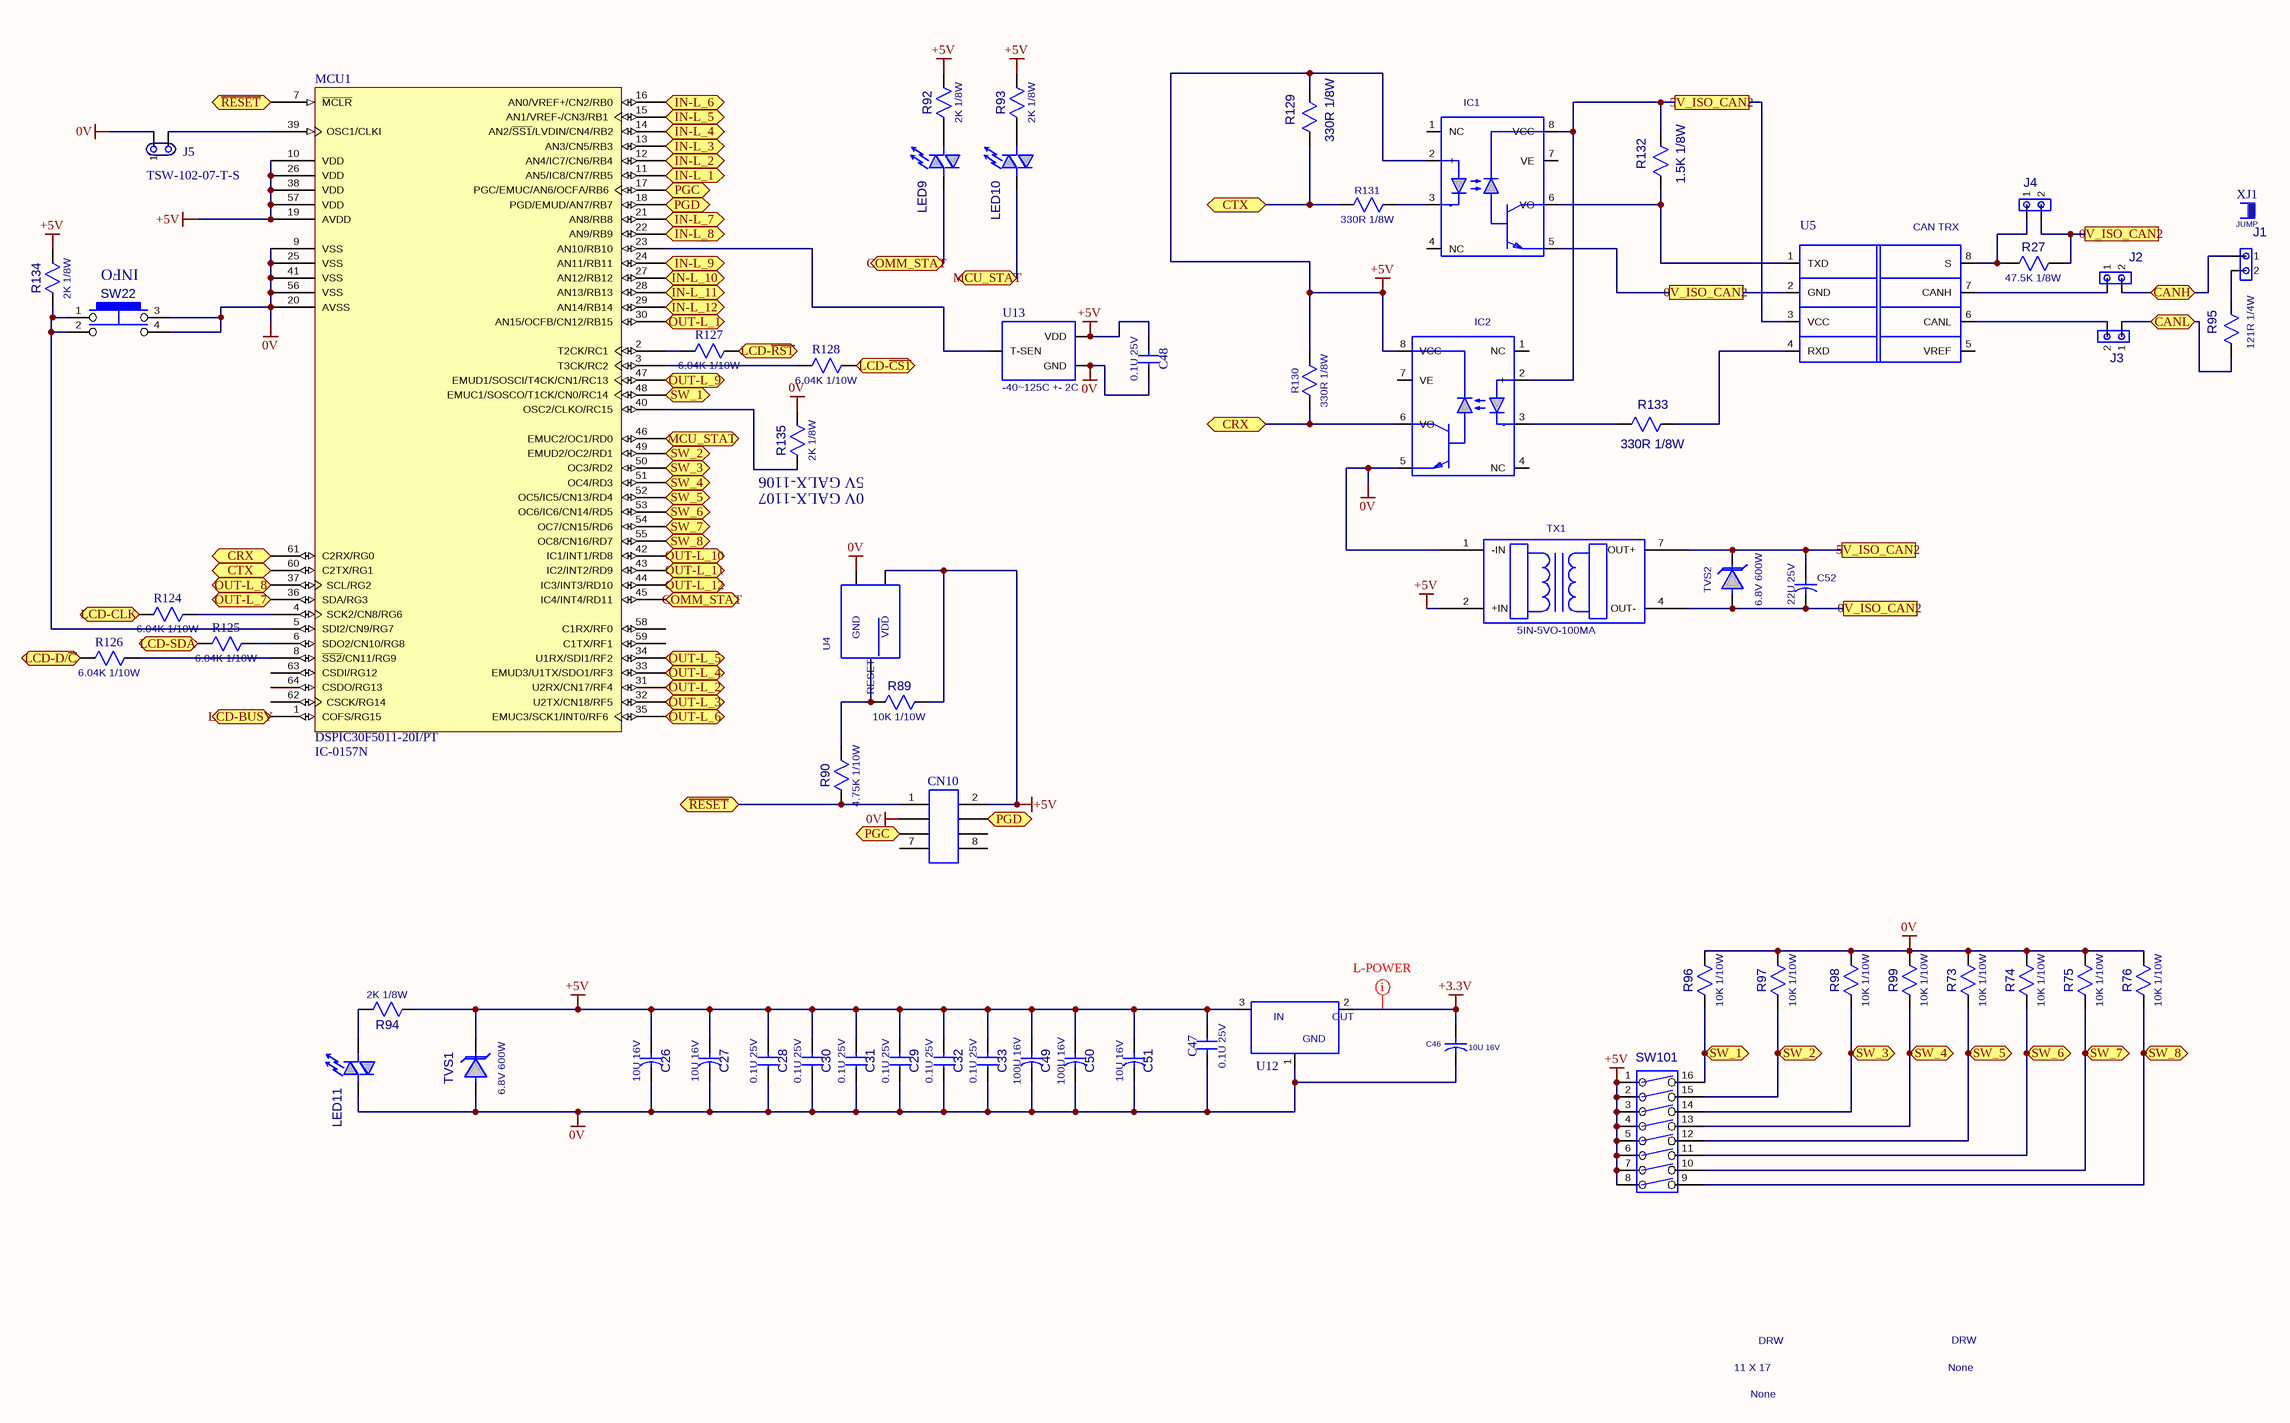
[diagram p4: GALX4-0047N_PCB-1109N_REV-A_Micro.SchDoc]

### Parts
C26  value 10U 16V  [1206POL]  (hidden comment: CAP-0102N)
C27  value 10U 16V  [1206POL]  (hidden comment: CAP-0102N)
C28  value 0.1U 25V  [0603]  (hidden comment: CAP-0112N)
C29  value 0.1U 25V  [0603]  (hidden comment: CAP-0112N)
C30  value 0.1U 25V  [0603]  (hidden comment: CAP-0112N)
C31  value 0.1U 25V  [0603]  (hidden comment: CAP-0112N)
C32  value 0.1U 25V  [0603]  (hidden comment: CAP-0112N)
C33  value 0.1U 25V  [0603]  (hidden comment: CAP-0112N)
C46  value 10U 16V  [1206POL]  (hidden comment: CAP-0102N)
C47  value 0.1U 25V  [0603]  (hidden comment: CAP-0112N)
C48  value 0.1U 25V  [0603]  (hidden comment: CAP-0112N)
C49  value 100U 16V  [D6.3]  (hidden comment: CAP-0120N)
C50  value 100U 16V  [D6.3]  (hidden comment: CAP-0120N)
C51  value 10U 16V  [1206POL]  (hidden comment: CAP-0102N)
C52  value 22U 25V  [D6.3]  (hidden comment: CAP-0097N)
CN10  CONN-0220N  [SCKT-4POS8PINDUALROWSMT]  (value not drawn)
IC1  IC-0114N  [SMD8]  (value not drawn)
IC2  IC-0114N  [SMD8]  (value not drawn)
J1  CONN-0295N  [JUMPER-2POS-SMT]  (value not drawn)
J2  CONN-0295N  [JUMPER-2POS-SMT]  (value not drawn)
J3  CONN-0295N  [JUMPER-2POS-SMT]  (value not drawn)
J4  CONN-0295N  [JUMPER-2POS-SMT]  (value not drawn)
J5  TSW-102-07-T-S  [TSW-102-07-T-S]
LED9  LED-0014N  [1206-LED-RED]  (value not drawn)
LED10  LED-0014N  [1206-LED-RED]  (value not drawn)
LED11  LED-0013N  [1206-LED-GREEN]  (value not drawn)
MCU1  IC-0157N  value DSPIC30F5011-20I/PT  [TQFP-64_N]
R27  value 47.5K 1/8W  [0805]  (hidden comment: RES-0280N)
R73  value 10K 1/10W  [0603]  (hidden comment: RES-0314N)
R74  value 10K 1/10W  [0603]  (hidden comment: RES-0314N)
R75  value 10K 1/10W  [0603]  (hidden comment: RES-0314N)
R76  value 10K 1/10W  [0603]  (hidden comment: RES-0314N)
R89  value 10K 1/10W  [0603]  (hidden comment: RES-0314N)
R90  value 4.75K 1/10W  [0603]  (hidden comment: RES-0317N)
R92  value 2K 1/8W  [0805]  (hidden comment: RES-0272N)
R93  value 2K 1/8W  [0805]  (hidden comment: RES-0272N)
R94  value 2K 1/8W  [0805]  (hidden comment: RES-0272N)
R95  value 121R 1/4W  [1206]  (hidden comment: RES-0269N)
R96  value 10K 1/10W  [0603]  (hidden comment: RES-0314N)
R97  value 10K 1/10W  [0603]  (hidden comment: RES-0314N)
R98  value 10K 1/10W  [0603]  (hidden comment: RES-0314N)
R99  value 10K 1/10W  [0603]  (hidden comment: RES-0314N)
R124  value 6.04K 1/10W  [0603]  (hidden comment: RES-0360N)
R125  value 6.04K 1/10W  [0603]  (hidden comment: RES-0360N)
R126  value 6.04K 1/10W  [0603]  (hidden comment: RES-0360N)
R127  value 6.04K 1/10W  [0603]  (hidden comment: RES-0360N)
R128  value 6.04K 1/10W  [0603]  (hidden comment: RES-0360N)
R129  value 330R 1/8W  [0805]  (hidden comment: RES-0291N)
R130  value 330R 1/8W  [0805]  (hidden comment: RES-0291N)
R131  value 330R 1/8W  [0805]  (hidden comment: RES-0291N)
R132  value 1.5K 1/8W  [0805]  (hidden comment: RES-0293N)
R133  value 330R 1/8W  [0805]  (hidden comment: RES-0291N)
R134  value 2K 1/8W  [0805]  (hidden comment: RES-0272N)
R135  value 2K 1/8W  [0805]  (hidden comment: RES-0272N)
SW22  SW-0071N  [PB_500X500-TH]  (value not drawn)
SW101  SW-0072N  [SMD-8DIPSWITCH]  (value not drawn)
TVS1  value 6.8V 600W  [SMB]  (hidden comment: DIOD-0086N)
TVS2  value 6.8V 600W  [SMB]  (hidden comment: DIOD-0086N)
TX1  value 5IN-5VO-100MA  [DC-DC-RECOM-0.5W-SMT]  (hidden comment: IC-0148N)
U4  IC-0112N  [SOIC8]  (value not drawn)
U5  value CAN TRX  [SOIC8]  (hidden comment: IC-0111N)
U12  IC-0163N  [DPAK]  (value not drawn)
U13  value -40~125C +- 2C  [SOT-23]  (hidden comment: IC-0183N)
XJ1  value JUMP  (hidden comment: CONN-0092N)  (mechanical)

### Ports
0V_ISO_CAN2, 5V_ISO_CAN2, CANH (bidir), CANL (bidir), COMM_STAT (bidir), CRX (bidir), CTX (bidir), IN-L_1 (bidir), IN-L_2 (bidir), IN-L_3 (bidir), IN-L_4 (bidir), IN-L_5 (bidir), IN-L_6 (bidir), IN-L_7 (bidir), IN-L_8 (bidir), IN-L_9 (bidir), IN-L_10 (bidir), IN-L_11 (bidir), IN-L_12 (bidir), LCD-BUSY (bidir), LCD-CLK (bidir), LCD-D/~{C} (bidir), LCD-SDA (bidir), LCD-~{CS1} (bidir), LCD-~{RST} (bidir), MCU_STAT (bidir), OUT-L_1 (bidir), OUT-L_2 (bidir), OUT-L_3 (bidir), OUT-L_4 (bidir), OUT-L_5 (bidir), OUT-L_6 (bidir), OUT-L_7 (bidir), OUT-L_8 (bidir), OUT-L_9 (bidir), OUT-L_10 (bidir), OUT-L_11 (bidir), OUT-L_12 (bidir), PGC (bidir), PGD (bidir), SW_1 (bidir), SW_2 (bidir), SW_3 (bidir), SW_4 (bidir), SW_5 (bidir), SW_6 (bidir), SW_7 (bidir), SW_8 (bidir), ~{RESET} (bidir)

### Nets
0V: C26.2 C27.2 C28.2(B) C29.2(B) C30.2(B) C31.2(B) C32.2(B) C33.2(B) C46.2 C47.1(A) C48.2(B) C49.2 C50.2 C51.2 CN10.3 IC2.5(GND) J5.1 LED11.1 MCU1.9(VSS) MCU1.20(AVSS) MCU1.25(VSS) MCU1.41(VSS) MCU1.56(VSS) R73.2 R74.2 R75.2 R76.2 R96.2 R97.2 R98.2 R99.2 R135.2 SW22.3 SW22.4 TVS1.1 TX1.1(-IN) U4.4 U12.1 U13.2(GND)
+3.3V: C46.1 U12.2
+5V: C26.1 C27.1 C28.1(A) C29.1(A) C30.1(A) C31.1(A) C32.1(A) C33.1(A) C47.2(B) C48.1(A) C49.1 C50.1 C51.1 CN10.2 IC1.2(+) IC2.8(VCC) MCU1.10(VDD) MCU1.19(AVDD) MCU1.26(VDD) MCU1.38(VDD) MCU1.57(VDD) R89.2 R92.2 R93.2 R94.1 R129.2 R130.2 R134.2 SW101.1 SW101.2 SW101.3 SW101.4 SW101.5 SW101.6 SW101.7 SW101.8 TVS1.2 TX1.2(+IN) U4.2 U12.3 U13.1(VDD)
0V_ISO_CAN2: C52.2 IC1.5(GND) J4.2 R27.2 TVS2.1 TX1.4(OUT-) U5.2(GND) ; port 0V_ISO_CAN2
5V_ISO_CAN2: C52.1 IC1.8(VCC) IC2.2(+) R132.2 TVS2.2 TX1.7(OUT+) U5.3(VCC) ; port 5V_ISO_CAN2
CANH: J1.1 J2.2 ; port CANH
CANL: J3.1 R95.1 ; port CANL
COMM_STAT: LED9.1 MCU1.45(IC4/INT4/RD11) ; port COMM_STAT
CRX: IC2.6(VO) MCU1.61(C2RX/RG0) R130.1 ; port CRX
CTX: MCU1.60(C2TX/RG1) R129.1 R131.1 ; port CTX
IN-L_1: MCU1.11(AN5/IC8/CN7/RB5) ; port IN-L_1
IN-L_2: MCU1.12(AN4/IC7/CN6/RB4) ; port IN-L_2
IN-L_3: MCU1.13(AN3/CN5/RB3) ; port IN-L_3
IN-L_4: MCU1.14(AN2/~{SS1}/LVDIN/CN4/RB2) ; port IN-L_4
IN-L_5: MCU1.15(AN1/VREF-/CN3/RB1) ; port IN-L_5
IN-L_6: MCU1.16(AN0/VREF+/CN2/RB0) ; port IN-L_6
IN-L_7: MCU1.21(AN8/RB8) ; port IN-L_7
IN-L_8: MCU1.22(AN9/RB9) ; port IN-L_8
IN-L_9: MCU1.24(AN11/RB11) ; port IN-L_9
IN-L_10: MCU1.27(AN12/RB12) ; port IN-L_10
IN-L_11: MCU1.28(AN13/RB13) ; port IN-L_11
IN-L_12: MCU1.29(AN14/RB14) ; port IN-L_12
LCD-BUSY: MCU1.1(COFS/RG15) ; port LCD-BUSY
LCD-~{CS1}: R128.2 ; port LCD-~{CS1}
LCD-CLK: R124.1 ; port LCD-CLK
LCD-D/~{C}: R126.1 ; port LCD-D/~{C}
LCD-~{RST}: R127.2 ; port LCD-~{RST}
LCD-SDA: R125.1 ; port LCD-SDA
MCU_STAT: LED10.1 MCU1.46(EMUC2/OC1/RD0) ; port MCU_STAT
OUT-L_1: MCU1.30(AN15/OCFB/CN12/RB15) ; port OUT-L_1
OUT-L_2: MCU1.31(U2RX/CN17/RF4) ; port OUT-L_2
OUT-L_3: MCU1.32(U2TX/CN18/RF5) ; port OUT-L_3
OUT-L_4: MCU1.33(EMUD3/U1TX/SDO1/RF3) ; port OUT-L_4
OUT-L_5: MCU1.34(U1RX/SDI1/RF2) ; port OUT-L_5
OUT-L_6: MCU1.35(EMUC3/SCK1/INT0/RF6) ; port OUT-L_6
OUT-L_7: MCU1.36(SDA/RG3) ; port OUT-L_7
OUT-L_8: MCU1.37(SCL/RG2) ; port OUT-L_8
OUT-L_9: MCU1.47(EMUD1/SOSCI/T4CK/CN1/RC13) ; port OUT-L_9
OUT-L_10: MCU1.42(IC1/INT1/RD8) ; port OUT-L_10
OUT-L_11: MCU1.43(IC2/INT2/RD9) ; port OUT-L_11
OUT-L_12: MCU1.44(IC3/INT3/RD10) ; port OUT-L_12
PGC: CN10.5 MCU1.17(PGC/EMUC/AN6/OCFA/RB6) ; port PGC
PGD: CN10.4 MCU1.18(PGD/EMUD/AN7/RB7) ; port PGD
~{RESET}: CN10.1 MCU1.7(~{MCLR}) R90.1 ; port ~{RESET}
SW_1: MCU1.48(EMUC1/SOSCO/T1CK/CN0/RC14) R96.1 SW101.16 ; port SW_1
SW_2: MCU1.49(EMUD2/OC2/RD1) R97.1 SW101.15 ; port SW_2
SW_3: MCU1.50(OC3/RD2) R98.1 SW101.14 ; port SW_3
SW_4: MCU1.51(OC4/RD3) R99.1 SW101.13 ; port SW_4
SW_5: MCU1.52(OC5/IC5/CN13/RD4) R73.1 SW101.12 ; port SW_5
SW_6: MCU1.53(OC6/IC6/CN14/RD5) R74.1 SW101.11 ; port SW_6
SW_7: MCU1.54(OC7/CN15/RD6) R75.1 SW101.10 ; port SW_7
SW_8: MCU1.55(OC8/CN16/RD7) R76.1 SW101.9 ; port SW_8
NetIC1_3: IC1.3(-) R131.2
NetIC1_6: IC1.6(VO) R132.1 U5.1(TXD)
NetIC2_3: IC2.3(-) R133.1
NetJ1_2: J1.2 R95.2
NetJ2_1: J2.1 U5.7(CANH)
NetJ3_2: J3.2 U5.6(CANL)
NetJ4_1: J4.1 R27.1 U5.8(S)
NetJ5_2: J5.2 MCU1.39(OSC1/CLKI)
NetLED9_2: LED9.2 R92.1
NetLED10_2: LED10.2 R93.1
NetLED11_2: LED11.2 R94.2
NetMCU1_2: MCU1.2(T2CK/RC1) R127.1
NetMCU1_3: MCU1.3(T3CK/RC2) R128.1
NetMCU1_4: MCU1.4(SCK2/CN8/RG6) R124.2
NetMCU1_5: MCU1.5(SDI2/CN9/RG7) R134.1 SW22.1 SW22.2
NetMCU1_6: MCU1.6(SDO2/CN10/RG8) R125.2
NetMCU1_8: MCU1.8(~{SS2}/CN11/RG9) R126.2
NetMCU1_23: MCU1.23(AN10/RB10) U13.3(T-SEN)
NetMCU1_40: MCU1.40(OSC2/CLKO/RC15) R135.1
NetR89_1: R89.1 R90.2 U4.1
NetR133_2: R133.2 U5.4(RXD)

Not connected (* = marked no-connect by the designer): CN10 6 7 8; IC1 1(NC) 4(NC) 7(VE); IC2 1(NC) 4(NC) 7(VE); MCU1 58(C1RX/RF0) 59(C1TX/RF1) 62(CSCK/RG14) 63(CSDI/RG12) 64(CSDO/RG13); SW22 5 6; U5 5(VREF)

### Layout directives
net class L-POWER: +3.3V

### Notes on the sheet
- INFO
- (near R135) 5V GALX-1106
- (near R135) 0V GALX-1107
- DRW
- 11 X 17
- None
- TITLE:
- S
- DWG BY
- E
- L
- V
- A
- T
- O
- R
- D
- I
- C
- 50 EAST 153rd STREET
- ENGINEER
- DWG. No.
- BRONX, N.Y. 10451
- REV
- DESCRIPTION
- ECN NO.
- DATE
- SIZE
- SCALE
- PART No.
- FILE NAME
- SHEET __ 0F __
- REV.
- (in symbol IC-0112N) GND; VDD; RESET
- (in symbol IC-0163N) IN; OUT; GND

### Library data of the parts
C26 C27 C46 C51 = CAP-0102N: C-1206-P-D-10U-16V-10%; MANUFACTURER: AVX; MFG PART ID: TAJA106K016R; GAL DESC.: CAP , 10UF 16V TANT 10% 1206 SMT; PLACE: S; UNIT $: $0.1533; GAL P/N: CAP-0102N; PART TYPE: 1206POL; VENDOR: *; VENDOR ID: *
C28-C33 C47 C48 = CAP-0112N: C-0603-D-0.1U-25V-10%; MANUFACTURER: KEMET; MFG PART ID: C0603C104K3RACTU; GAL DESC.: CAP, 0.1UF 25V 10% CERM 0603 SMT; PLACE: S; UNIT $: $0.0087; GAL P/N: CAP-0112N; PART TYPE: 0603-020; VENDOR: *; VENDOR ID: *
C49 C50 = CAP-0120N: C-D6.3-D-100U-16V-20%; MANUFACTURER: UNITED CHEMI-CON; MFG PART ID: EMVY160ADA101MF55G; GAL DESC.: CAP, 100UF 16V 20% 6.3MM ELECT SMT; PLACE: S; UNIT $: $0.0800; GAL P/N: CAP-0120N; PART TYPE: ALUM_D; VENDOR: *; VENDOR ID: *
C52 = CAP-0097N: C-D6.3-D-22U-25V-20%; MANUFACTURER: NICHICON; MFG PART ID: UWT1E220MCL1GB; GAL DESC.: CAP, 22UF 25V 20% 6.3MM ELECT SMT; PLACE: S; UNIT $: $0.0854; GAL P/N: CAP-0097N; PART TYPE: ALUM_D; VENDOR: *; VENDOR ID: *
CN10 = CONN-0220N: SCKT-2X4-.1PITCH; MANUFACTURER: SAMTEC; MFG PART ID: SSM-104-22-F-D-VS-K-TR; UNIT $: $0.2730; PLACE: S; GAL DESC.: CONN,SCKT(F) 8P 2X4POS .100" .290"H SMT; VENDOR: *; PART TYPE: CONN-0220N; GAL P/N: CONN-0220N; VENDOR ID: *; Value: *
IC1 IC2 = IC-0114N: OPTOISO-1CH-HS-SMD8; MANUFACTURER: FAIRCHILD SEMI; Value: 6N137S; GAL DESC.: OPTOCOUPLER,LOG-OUT HS SMD 8DIP SMT; PLACE: S; UNIT $: $0.4000; MFG PART ID: 6N137S; VENDOR ID: *; VENDOR: *; GAL P/N: IC-0114N; PART TYPE: SMD8
J1-J4 = CONN-0295N: HEADER_2POS_100MIL_SMT; MANUFACTURER: SAMTEC; MFG PART ID: ASP-152787-01; UNIT $: $0.1990; PLACE: S; GAL DESC.: HEADER, 2 POS. 0.100 STRIP HIGH TEMP SMT; Value: *; VENDOR: *; PART TYPE: CONN-0295N; GAL P/N: CONN-0295N; VENDOR ID: *
J5 = CONN-2 POS HEADER: CONN 2 POS HEADER .100"; MANUFACTURER: SAMTEC; PLACE: PTP; GAL DESC.: CONN 2 POS HEADER .100"; MFG PART ID: TSW-102-07-T-S; PART TYPE: TSW; RoHs COMPLIANT: YES; TEMPERATURE: -55°C to +105°C; Value: 2 POS HEADER .100"
LED9 LED10 = LED-0014N: LED-1206-BI-R; MANUFACTURER: SUNLED; MFG PART ID: XZMDKMDK55W-7; Value: RED; GAL DESC.: LED RED BI-POLAR DOME LENS 1206 SMT; PLACE: S; UNIT $: $0.1380; GAL P/N: LED-0014N; PART TYPE: 1206LED; VENDOR: SUNLED; VENDOR ID: LED-0014N
LED11 = LED-0013N: as IO1 on sheet GALX4-0047N_PCB-1109N_REV-A_io_2; GAL P/N: LED-0013N; PART TYPE: 1206LED; VENDOR: SUNLED; VENDOR ID: LED-0013N
MCU1 = IC-0157N: MCU-DSPIC30F5011-20I/PT; MANUFACTURER: MICROCHIP; PLACE: S; GAL DESC.: IC,DSPIC MCU/DSP 66K 64TQFP SMT; UNIT $: $4.0000; MFG PART ID: DSPIC30F5011-20I/PT; GAL P/N: IC-0157N; VENDOR: MICROCHIP; PART TYPE: QFP64-10X10; VENDOR ID: *
R27 = RES-0280N: R-0805-B-47.5K-1/8-1%; MANUFACTURER: KOA SPEER; MFG PART ID: RK73H2ATTD4752F; PLACE: S; GAL DESC.: RESISTOR,47.5KOHM 1/8W 1% 0805 SMT; UNIT $: $0.0050; GAL P/N: RES-0280N; PART TYPE: 0805; VENDOR: *; VENDOR ID: *
R73-R76 R89 R96-R99 = RES-0314N: as R41 on sheet GALX4-0047N_PCB-1109N_REV-A_io_1; GAL P/N: RES-0314N; PART TYPE: 0603; VENDOR: *; VENDOR ID: *
R90 = RES-0317N: R-0603-B-4.75K-1/10-1%; MANUFACTURER: PANASONIC-ECG; MFG PART ID: ERJ-3EKF4751V; PLACE: S; GAL DESC.: RES, 4.75KOHM 1/10W 1% 0603 SMT; UNIT $: $0.0034; GAL P/N: RES-0317N; PART TYPE: 0603; VENDOR: *; VENDOR ID: *
R92-R94 R134 R135 = RES-0272N: R-0805-B-2.0K-1/8-5%; MANUFACTURER: KOA SPEER; MFG PART ID: RK73B2ATTD202J; PLACE: S; GAL DESC.: RESISTOR,2KOHM 1/8W 5% 0805 SMT; UNIT $: $0.0038; GAL P/N: RES-0272N; PART TYPE: 0805; VENDOR: *; VENDOR ID: *
R95 = RES-0269N: R-1206-A-121R-1/4-1%; MANUFACTURER: VISHAY/DALE; MFG PART ID: CRCW1206121RFKEA; PLACE: S; GAL DESC.: RESISTOR,121OHM 1/4W 1% 1206 SMT; UNIT $: $0.0090; GAL P/N: RES-0269N; PART TYPE: 1206; VENDOR: *; VENDOR ID: *
R124-R128 = RES-0360N: R-0603-B-6.04K-1/10-1%; MANUFACTURER: VISHAY/DALE; MFG PART ID: CRCW06036K04FKEA; PLACE: S; GAL DESC.: RES, 6.04KOHM 1/10W 1% 0603 SMT; UNIT $: $0.0060; GAL P/N: RES-0360N; PART TYPE: 0603; VENDOR: *; VENDOR ID: *
R129-R131 R133 = RES-0291N: as R30 on sheet GALX4-0047N_PCB-1109N_REV-A_io_2; GAL P/N: RES-0291N; PART TYPE: 0805; VENDOR: *; VENDOR ID: *
R132 = RES-0293N: R-0805-B-1.5K-1/8-1%; MANUFACTURER: KOA SPEER; MFG PART ID: RK73H2ATTD1501F; PLACE: S; GAL DESC.: RESISTOR,1.5KOHM 1/8W 1% 0805 SMT; UNIT $: $0.0060; GAL P/N: RES-0293N; PART TYPE: 0805; VENDOR: *; VENDOR ID: *
SW22 = SW-0071N: PB_500X500-TH; MANUFACTURER: OMRON; MFG PART ID: B3W-4050; GAL DESC.: SWITCH PUSHBUT TACT 12MM MOM 200GF SEALD; PLACE: M; UNIT $: $0.3000; Value: *; GAL P/N: SW-0071N; PART TYPE: PB
SW101 = SW-0072N: DIPSW-8CH-SMT; MANUFACTURER: ESWITCH; MFG PART ID: KAJ08TGGR; UNIT $: $0.6000; PLACE: S; GAL DESC.: SWITCH DIP LOW PROFILE 8POS SMT; VENDOR: *; PART TYPE: SMD16-SW; GAL P/N: SW-0072N; VENDOR ID: *; Value: *
TVS1 TVS2 = DIOD-0086N: TVS-6.8V-600W-SMB; MANUFACTURER: ON SEMI; MFG PART ID: P6SMB6.8AT3G; GAL DESC.: DIODE,TVS ZENER UNIDIR 600W 6.8V SMB SMT; PLACE: S; UNIT $: $0.1000; GAL P/N: DIOD-0086N; PART TYPE: SMB; VENDOR: *; VENDOR ID: *
TX1 = IC-0148N: DC-DC-5VIN-5VO-RECOM-0.5W-SMT; MANUFACTURER: RECOM; MFG PART ID: RZ-0505S/P; UNIT $: $6.6053; PLACE: S; GAL DESC.: IC,DC-DC 1/2W SNGL OUT 5-5VDC SMT; VENDOR: *; PART TYPE: IC-0148N; GAL P/N: IC-0148N; VENDOR ID: *
U4 = IC-0112N: RESETGEN-5V-SOIC; MFG PART ID: MC34064D-5R2G; MANUFACTURER: ON-SEMI; Value: 5V LOW V RESET GEN; GAL DESC.: IC SENSOR UNDERVOLTAGE 8SOIC SMT; PLACE: S; UNIT $: $0.2400; VENDOR ID: *; VENDOR: *; GAL P/N: IC-0112N; PART TYPE: SOIC8
U5 = IC-0111N: CAN_TRX-SOIC8; MFG PART ID: PCA82C251TD-T; MANUFACTURER: PHILIPS; GAL DESC.: IC, CAN TRANSCEIVER 5V HS 8-SOIC SMT; PLACE: S; UNIT $: $0.7800; VENDOR ID: *; VENDOR: *; GAL P/N: IC-0111N; PART TYPE: SOIC8
U12 = IC-0163N: VREG-3.3VO-1A-DPAK; MFG PART ID: FAN1117AD33X; MANUFACTURER: FAIRCHILD SEMI; Value: 3.3VO 1A; GAL DESC.: IC, REG LDO 1A 3.3V TO-252 DPAK SMT; PLACE: S; UNIT $: $0.3800; VENDOR ID: *; VENDOR: *; GAL P/N: IC-0163N; PART TYPE: DPAK
U13 = IC-0183N: TEMPSENSE-M45TO120C-SOT23; MFG PART ID: MCP9701AT-E/TT; MANUFACTURER: MICROCHIP; GAL DESC.: IC,TEMP SENS -40~125C 3.1-5.5V SOT23 SMT; PLACE: S; UNIT $: $0.2400; VENDOR ID: *; VENDOR: *; GAL P/N: IC-0183N; PART TYPE: SOT23
XJ1 = CONN-0092N: JUMPER_BLUE; MANUFACTURER: 3M; MFG PART ID: 929955-06; UNIT $: $0.1550; PLACE: M; GAL DESC.: JUMPER,2 POS .100 SHORT GLD/NICKEL BLUE; VENDOR: *; PART TYPE: CONN-0092N; GAL P/N: CONN-0092N; VENDOR ID: *

## Sheet GALX4-0047N_PCB-1109N_REV-A_LCD.SchDoc
size 431 x 279 mm; SheetNumber: 1; SheetTotal: 1; DocumentName: Sheet1.SCHDOC
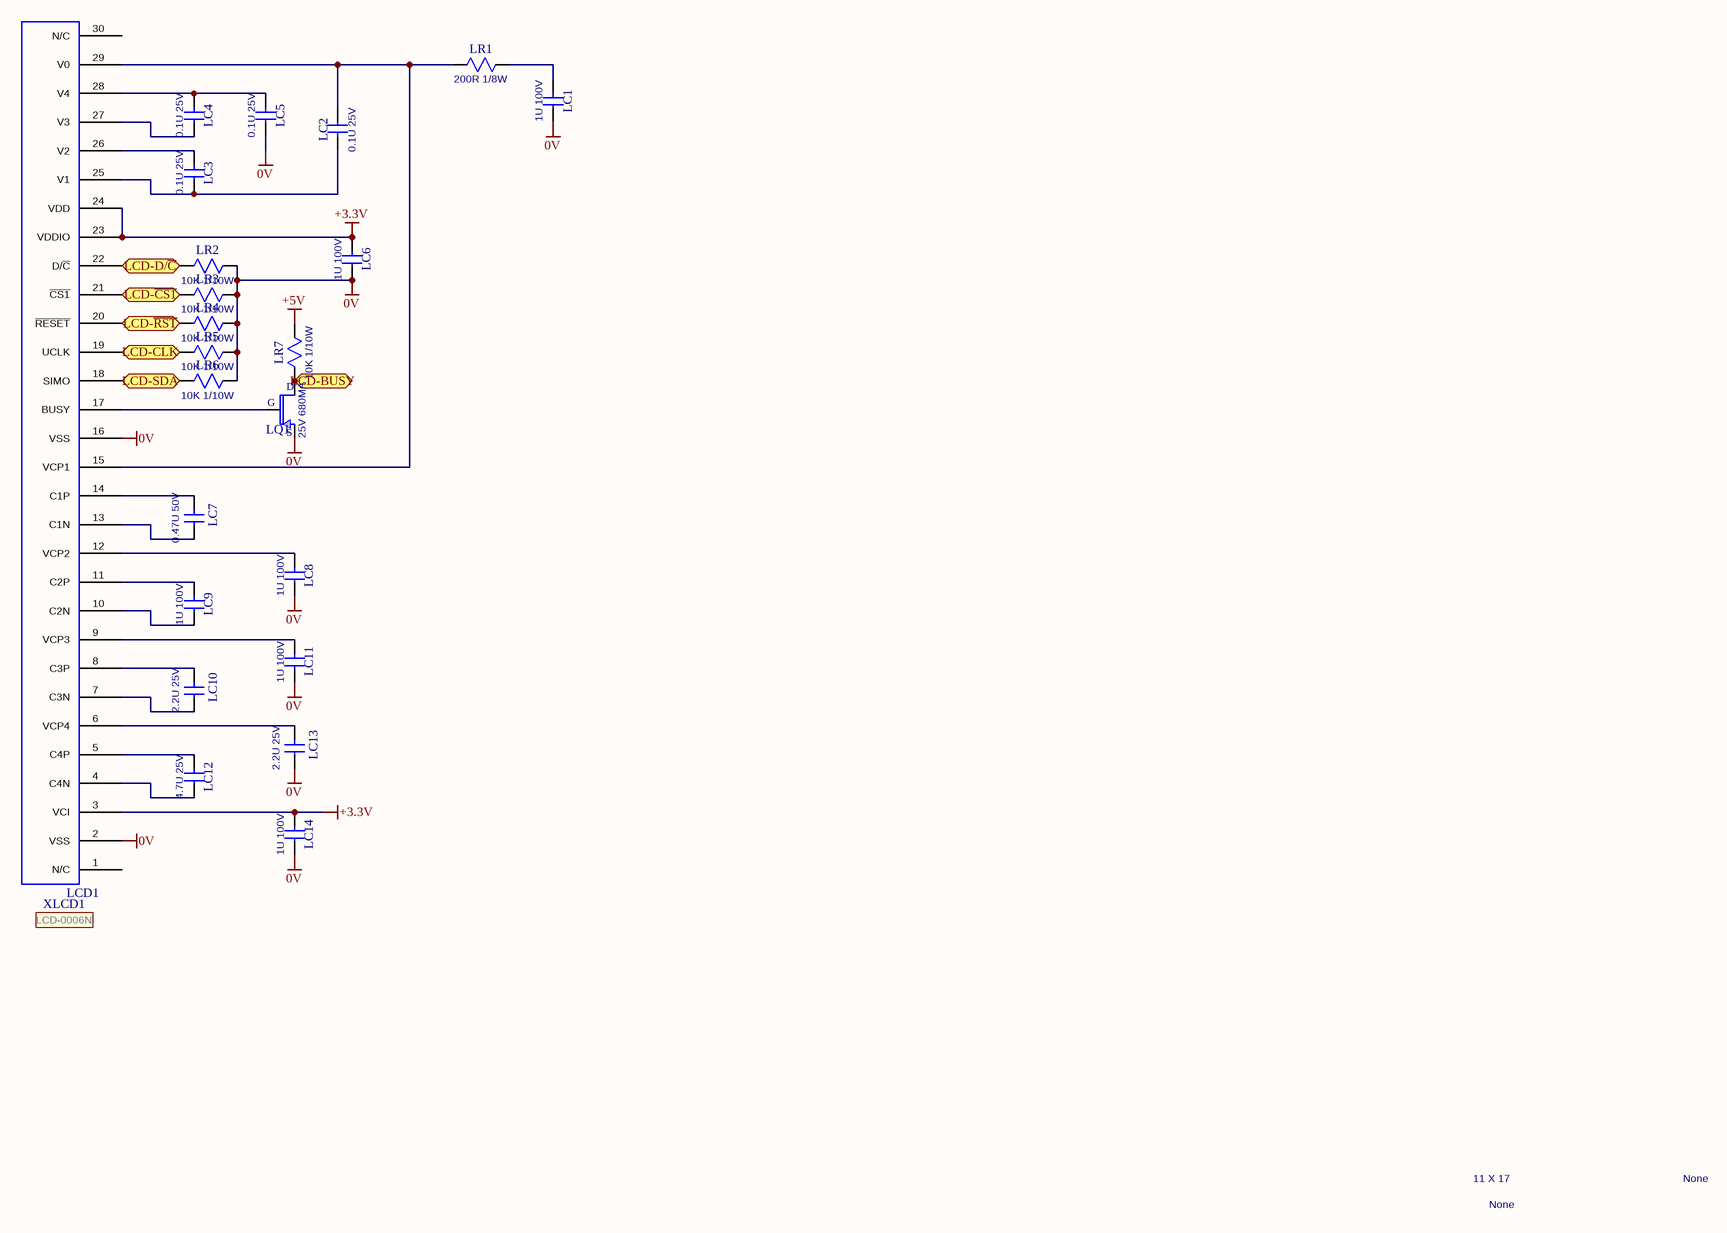
[diagram p5: GALX4-0047N_PCB-1109N_REV-A_LCD.SchDoc]

### Parts
LC1  value 1U 100V  [1206]  (hidden comment: CAP-0110N)
LC2  value 0.1U 25V  [0603]  (hidden comment: CAP-0112N)
LC3  value 0.1U 25V  [0603]  (hidden comment: CAP-0112N)
LC4  value 0.1U 25V  [0603]  (hidden comment: CAP-0112N)
LC5  value 0.1U 25V  [0603]  (hidden comment: CAP-0112N)
LC6  value 1U 100V  [1206]  (hidden comment: CAP-0110N)
LC7  value 0.47U 50V  [0805]  (hidden comment: CAP-0123N)
LC8  value 1U 100V  [1206]  (hidden comment: CAP-0110N)
LC9  value 1U 100V  [1206]  (hidden comment: CAP-0110N)
LC10  value 2.2U 25V  [0805]  (hidden comment: CAP-0124N)
LC11  value 1U 100V  [1206]  (hidden comment: CAP-0110N)
LC12  value 4.7U 25V  [0805]  (hidden comment: CAP-0098N)
LC13  value 2.2U 25V  [0805]  (hidden comment: CAP-0124N)
LC14  value 1U 100V  [1206]  (hidden comment: CAP-0110N)
LCD1  CONN-0278N  [LCD-KENT-120X33-NOTIT]  (value not drawn)
LQ1  value 25V 680MA  [SOT-23]  (hidden comment: XTOR-0020N)
LR1  value 200R 1/8W  [0805]  (hidden comment: RES-0332N)
LR2  value 10K 1/10W  [0603]  (hidden comment: RES-0314N)
LR3  value 10K 1/10W  [0603]  (hidden comment: RES-0314N)
LR4  value 10K 1/10W  [0603]  (hidden comment: RES-0314N)
LR5  value 10K 1/10W  [0603]  (hidden comment: RES-0314N)
LR6  value 10K 1/10W  [0603]  (hidden comment: RES-0314N)
LR7  value 10K 1/10W  [0603]  (hidden comment: RES-0314N)
XLCD1  LCD-0006N  (mechanical)

### Ports
LCD-BUSY (bidir), LCD-CLK (bidir), LCD-D/~{C} (bidir), LCD-SDA (bidir), LCD-~{CS1} (bidir), LCD-~{RST} (bidir)

### Nets
0V: LC1.2(B) LC5.2(B) LC6.2(B) LC8.2(B) LC11.2(B) LC13.2(B) LC14.2(B) LCD1.2(VSS) LCD1.16(VSS) LQ1.3(S) LR2.2 LR3.2 LR4.2 LR5.2 LR6.2
+3.3V: LC6.1(A) LC14.1(A) LCD1.3(VCI) LCD1.23(VDDIO) LCD1.24(VDD)
+5V: LR7.2
LCD-BUSY: LQ1.2(D) LR7.1 ; port LCD-BUSY
LCD-~{CS1}: LCD1.21(~{CS1}) LR3.1 ; port LCD-~{CS1}
LCD-CLK: LCD1.19(UCLK) LR5.1 ; port LCD-CLK
LCD-D/~{C}: LCD1.22(D/~{C}) LR2.1 ; port LCD-D/~{C}
LCD-~{RST}: LCD1.20(~{RESET}) LR4.1 ; port LCD-~{RST}
LCD-SDA: LCD1.18(SIMO) LR6.1 ; port LCD-SDA
NetLC1_1: LC1.1(A) LR1.2
NetLC2_1: LC2.1(A) LC3.2(B) LCD1.25(V1)
NetLC2_2: LC2.2(B) LCD1.15(VCP1) LCD1.29(V0) LR1.1
NetLC3_1: LC3.1(A) LCD1.26(V2)
NetLC4_1: LC4.1(A) LC5.1(A) LCD1.28(V4)
NetLC4_2: LC4.2(B) LCD1.27(V3)
NetLC7_1: LC7.1(A) LCD1.14(C1P)
NetLC7_2: LC7.2(B) LCD1.13(C1N)
NetLC8_1: LC8.1(A) LCD1.12(VCP2)
NetLC9_1: LC9.1(A) LCD1.11(C2P)
NetLC9_2: LC9.2(B) LCD1.10(C2N)
NetLC10_1: LC10.1(A) LCD1.8(C3P)
NetLC10_2: LC10.2(B) LCD1.7(C3N)
NetLC11_1: LC11.1(A) LCD1.9(VCP3)
NetLC12_1: LC12.1(A) LCD1.5(C4P)
NetLC12_2: LC12.2(B) LCD1.4(C4N)
NetLC13_1: LC13.1(A) LCD1.6(VCP4)
NetLCD1_17: LCD1.17(BUSY) LQ1.1(G)

Not connected (* = marked no-connect by the designer): LCD1 1(N/C) 30(N/C)

### Notes on the sheet
- 11 X 17
- None
- TITLE:
- S
- DWG BY
- E
- L
- V
- A
- T
- O
- R
- D
- I
- C
- 50 EAST 153rd STREET
- ENGINEER
- DWG. No.
- BRONX, N.Y. 10451
- REV
- DESCRIPTION
- ECN NO.
- DATE
- SIZE
- SCALE
- PART No.
- FILE NAME
- SHEET __ 0F __
- REV.

### Library data of the parts
LC1 LC6 LC8 LC9 LC11 LC14 = CAP-0110N: C-1206-D-1U-100V-10%; MANUFACTURER: MURATA; MFG PART ID: GRM31CR72A105KA01L; GAL DESC.: CAP, 1UF 100V 10% X7R CERM 1206 SMT; PLACE: S; UNIT $: $0.1400; GAL P/N: CAP-0110N; PART TYPE: 1206POL; VENDOR: *; VENDOR ID: *
LC2-LC5 = CAP-0112N: as C28 on sheet GALX4-0047N_PCB-1109N_REV-A_Micro; GAL P/N: CAP-0112N; PART TYPE: 0603-020; VENDOR: *; VENDOR ID: *
LC7 = CAP-0123N: C-0805-D-0.47U-50V-10%; MANUFACTURER: MURATA; MFG PART ID: GRM21BR71H474KA88L; GAL DESC.: CAP,0.47UF 50V X7R CERM 0805 SMT; PLACE: S; UNIT $: $0.0530; GAL P/N: CAP-0123N; PART TYPE: 0805-050; VENDOR: *; VENDOR ID: *
LC10 LC13 = CAP-0124N: C-0805-D-2.2U-25V-10%; MANUFACTURER: PANASONIC-ECG; MFG PART ID: ECJ-2FB1E225K; GAL DESC.: CAP,2.2UF 25V X5R CERM 0805 SMT; PLACE: S; UNIT $: $0.0658; GAL P/N: CAP-0124N; PART TYPE: 0805-050; VENDOR: *; VENDOR ID: *
LC12 = CAP-0098N: as C9 on sheet GALX4-0047N_PCB-1109N_REV-A_io_1; GAL P/N: CAP-0098N; PART TYPE: 0805-050; VENDOR: *; VENDOR ID: *
LCD1 = CONN-0278N: FLEX-CABLE-30POS-0.5MM; MANUFACTURER: HIROSE; MFG PART ID: FH12S-30S-0.5SH(55); UNIT $: $0.5800; PLACE: S; GAL DESC.: CONN,FLEX CBL CONN BOT CNTCT 30POS 0.5MM; VENDOR: *; PART TYPE: CONN-0278N; GAL P/N: CONN-0278N; VENDOR ID: *
LQ1 = XTOR-0020N: NMOS-25V-680MA-SOT23; MANUFACTURER: FAIRCHILD SEMI; MFG PART ID: FDV303N; GAL DESC.: MOSFET, N-CH 25V 680MA SOT23 SMT; PLACE: S; UNIT $: $0.0760; GAL P/N: XTOR-0020N; PART TYPE: SOT23; VENDOR: *; VENDOR ID: *
LR1 = RES-0332N: R-0805-A-200R-1/8-5%; MANUFACTURER: VISHAY/DALE; MFG PART ID: CRCW0805200RJNEA; PLACE: S; GAL DESC.: RES,200OHM 1/8W 5% 0805 SMT; UNIT $: $0.0038; GAL P/N: RES-0332N; PART TYPE: 0805; VENDOR: *; VENDOR ID: *
LR2-LR7 = RES-0314N: as R41 on sheet GALX4-0047N_PCB-1109N_REV-A_io_1; GAL P/N: RES-0314N; PART TYPE: 0603; VENDOR: *; VENDOR ID: *
XLCD1 = LCD-0006N: LCD,EPAPER 119X33PX BISTABLE BLUE/WHITE; MANUFACTURER: KENT DISPLAYS INC; MFG PART ID: 01600006301; UNIT $: $5.5000; PLACE: PW; Z-NOTES: STICK DOWN WITH TAPE/GLUE; VENDOR: *; PART TYPE: LCD; VENDOR ID: *; GAL DESC.: LCD,EPAPER 119X33PX BISTABLE BLUE/WHITE; GAL P/N: LCD-0006N

## Nets that join several sheets
0V: GALX4-0047N_PCB-1109N_REV-A_io_1 (29 pins), GALX4-0047N_PCB-1109N_REV-A_Micro (39 pins), GALX4-0047N_PCB-1109N_REV-A_LCD (15 pins)
+3.3V: GALX4-0047N_PCB-1109N_REV-A_Micro (C46.1 U12.2), GALX4-0047N_PCB-1109N_REV-A_LCD (5 pins)
+5V: GALX4-0047N_PCB-1109N_REV-A_io_1 (17 pins), GALX4-0047N_PCB-1109N_REV-A_io_2 (12 pins), GALX4-0047N_PCB-1109N_REV-A_Micro (41 pins), GALX4-0047N_PCB-1109N_REV-A_LCD (LR7.2)
24C: GALX4-0047N_PCB-1109N_REV-A_io_1 (28 pins), GALX4-0047N_PCB-1109N_REV-A_io_2 (24 pins)
+24V: GALX4-0047N_PCB-1109N_REV-A_io_1 (BR1.1 C25.1 D3.2), GALX4-0047N_PCB-1109N_REV-A_io_2 (36 pins)
CANH: GALX4-0047N_PCB-1109N_REV-A_io_1 (CN6.9 CN7.9), GALX4-0047N_PCB-1109N_REV-A_Micro (J1.1 J2.2)
CANL: GALX4-0047N_PCB-1109N_REV-A_io_1 (CN6.10 CN7.10), GALX4-0047N_PCB-1109N_REV-A_Micro (J3.1 R95.1)
IN-L_1: GALX4-0047N_PCB-1109N_REV-A_io_1 (C9.1 R33.1 R41.1), GALX4-0047N_PCB-1109N_REV-A_Micro (MCU1.11)
IN-L_2: GALX4-0047N_PCB-1109N_REV-A_io_1 (C10.1 R34.1 R42.1), GALX4-0047N_PCB-1109N_REV-A_Micro (MCU1.12)
IN-L_3: GALX4-0047N_PCB-1109N_REV-A_io_1 (C11.1 R35.1 R43.1), GALX4-0047N_PCB-1109N_REV-A_Micro (MCU1.13)
IN-L_4: GALX4-0047N_PCB-1109N_REV-A_io_1 (C12.1 R36.1 R44.1), GALX4-0047N_PCB-1109N_REV-A_Micro (MCU1.14)
IN-L_5: GALX4-0047N_PCB-1109N_REV-A_io_1 (C38.1 R104.1 R108.1), GALX4-0047N_PCB-1109N_REV-A_Micro (MCU1.15)
IN-L_6: GALX4-0047N_PCB-1109N_REV-A_io_1 (C39.1 R105.1 R109.1), GALX4-0047N_PCB-1109N_REV-A_Micro (MCU1.16)
IN-L_7: GALX4-0047N_PCB-1109N_REV-A_io_1 (C40.1 R106.1 R110.1), GALX4-0047N_PCB-1109N_REV-A_Micro (MCU1.21)
IN-L_8: GALX4-0047N_PCB-1109N_REV-A_io_1 (C41.1 R107.1 R111.1), GALX4-0047N_PCB-1109N_REV-A_Micro (MCU1.22)
IN-L_9: GALX4-0047N_PCB-1109N_REV-A_io_1 (C13.1 R37.1 R45.1), GALX4-0047N_PCB-1109N_REV-A_Micro (MCU1.24)
IN-L_10: GALX4-0047N_PCB-1109N_REV-A_io_1 (C14.1 R38.1 R46.1), GALX4-0047N_PCB-1109N_REV-A_Micro (MCU1.27)
IN-L_11: GALX4-0047N_PCB-1109N_REV-A_io_1 (C15.1 R39.1 R47.1), GALX4-0047N_PCB-1109N_REV-A_Micro (MCU1.28)
IN-L_12: GALX4-0047N_PCB-1109N_REV-A_io_1 (C16.1 R40.1 R48.1), GALX4-0047N_PCB-1109N_REV-A_Micro (MCU1.29)
IO_1: GALX4-0047N_PCB-1109N_REV-A_io_1 (R1.1), GALX4-0047N_PCB-1109N_REV-A_io_2 (5 pins)
IO_2: GALX4-0047N_PCB-1109N_REV-A_io_1 (R2.1), GALX4-0047N_PCB-1109N_REV-A_io_2 (5 pins)
IO_3: GALX4-0047N_PCB-1109N_REV-A_io_1 (R3.1), GALX4-0047N_PCB-1109N_REV-A_io_2 (5 pins)
IO_4: GALX4-0047N_PCB-1109N_REV-A_io_1 (R4.1), GALX4-0047N_PCB-1109N_REV-A_io_2 (5 pins)
IO_5: GALX4-0047N_PCB-1109N_REV-A_io_1 (R116.1), GALX4-0047N_PCB-1109N_REV-A_io_2 (5 pins)
IO_6: GALX4-0047N_PCB-1109N_REV-A_io_1 (R117.1), GALX4-0047N_PCB-1109N_REV-A_io_2 (5 pins)
IO_7: GALX4-0047N_PCB-1109N_REV-A_io_1 (R118.1), GALX4-0047N_PCB-1109N_REV-A_io_2 (5 pins)
IO_8: GALX4-0047N_PCB-1109N_REV-A_io_1 (R119.1), GALX4-0047N_PCB-1109N_REV-A_io_2 (5 pins)
IO_9: GALX4-0047N_PCB-1109N_REV-A_io_1 (R5.1), GALX4-0047N_PCB-1109N_REV-A_io_2 (5 pins)
IO_10: GALX4-0047N_PCB-1109N_REV-A_io_1 (R6.1), GALX4-0047N_PCB-1109N_REV-A_io_2 (5 pins)
IO_11: GALX4-0047N_PCB-1109N_REV-A_io_1 (R7.1), GALX4-0047N_PCB-1109N_REV-A_io_2 (5 pins)
IO_12: GALX4-0047N_PCB-1109N_REV-A_io_1 (R8.1), GALX4-0047N_PCB-1109N_REV-A_io_2 (5 pins)
LCD-BUSY: GALX4-0047N_PCB-1109N_REV-A_Micro (MCU1.1), GALX4-0047N_PCB-1109N_REV-A_LCD (LQ1.2 LR7.1)
LCD-~{CS1}: GALX4-0047N_PCB-1109N_REV-A_Micro (R128.2), GALX4-0047N_PCB-1109N_REV-A_LCD (LCD1.21 LR3.1)
LCD-CLK: GALX4-0047N_PCB-1109N_REV-A_Micro (R124.1), GALX4-0047N_PCB-1109N_REV-A_LCD (LCD1.19 LR5.1)
LCD-D/~{C}: GALX4-0047N_PCB-1109N_REV-A_Micro (R126.1), GALX4-0047N_PCB-1109N_REV-A_LCD (LCD1.22 LR2.1)
LCD-~{RST}: GALX4-0047N_PCB-1109N_REV-A_Micro (R127.2), GALX4-0047N_PCB-1109N_REV-A_LCD (LCD1.20 LR4.1)
LCD-SDA: GALX4-0047N_PCB-1109N_REV-A_Micro (R125.1), GALX4-0047N_PCB-1109N_REV-A_LCD (LCD1.18 LR6.1)
OUT-L_1: GALX4-0047N_PCB-1109N_REV-A_io_2 (R81.1), GALX4-0047N_PCB-1109N_REV-A_Micro (MCU1.30)
OUT-L_2: GALX4-0047N_PCB-1109N_REV-A_io_2 (R82.1), GALX4-0047N_PCB-1109N_REV-A_Micro (MCU1.31)
OUT-L_3: GALX4-0047N_PCB-1109N_REV-A_io_2 (R83.1), GALX4-0047N_PCB-1109N_REV-A_Micro (MCU1.32)
OUT-L_4: GALX4-0047N_PCB-1109N_REV-A_io_2 (R84.1), GALX4-0047N_PCB-1109N_REV-A_Micro (MCU1.33)
OUT-L_5: GALX4-0047N_PCB-1109N_REV-A_io_2 (R85.1), GALX4-0047N_PCB-1109N_REV-A_Micro (MCU1.34)
OUT-L_6: GALX4-0047N_PCB-1109N_REV-A_io_2 (R86.1), GALX4-0047N_PCB-1109N_REV-A_Micro (MCU1.35)
OUT-L_7: GALX4-0047N_PCB-1109N_REV-A_io_2 (R87.1), GALX4-0047N_PCB-1109N_REV-A_Micro (MCU1.36)
OUT-L_8: GALX4-0047N_PCB-1109N_REV-A_io_2 (R88.1), GALX4-0047N_PCB-1109N_REV-A_Micro (MCU1.37)
OUT-L_9: GALX4-0047N_PCB-1109N_REV-A_io_2 (R30.1), GALX4-0047N_PCB-1109N_REV-A_Micro (MCU1.47)
OUT-L_10: GALX4-0047N_PCB-1109N_REV-A_io_2 (R31.1), GALX4-0047N_PCB-1109N_REV-A_Micro (MCU1.42)
OUT-L_11: GALX4-0047N_PCB-1109N_REV-A_io_2 (R32.1), GALX4-0047N_PCB-1109N_REV-A_Micro (MCU1.43)
OUT-L_12: GALX4-0047N_PCB-1109N_REV-A_io_2 (R77.1), GALX4-0047N_PCB-1109N_REV-A_Micro (MCU1.44)